# EasyEDA schematic Project-12 11.json

## Sheets
1 Sheet_1: TITLE: Sheet_1; REV: 1.0; Date: 2024-11-12; Sheet: 1/1; Company: Your Company
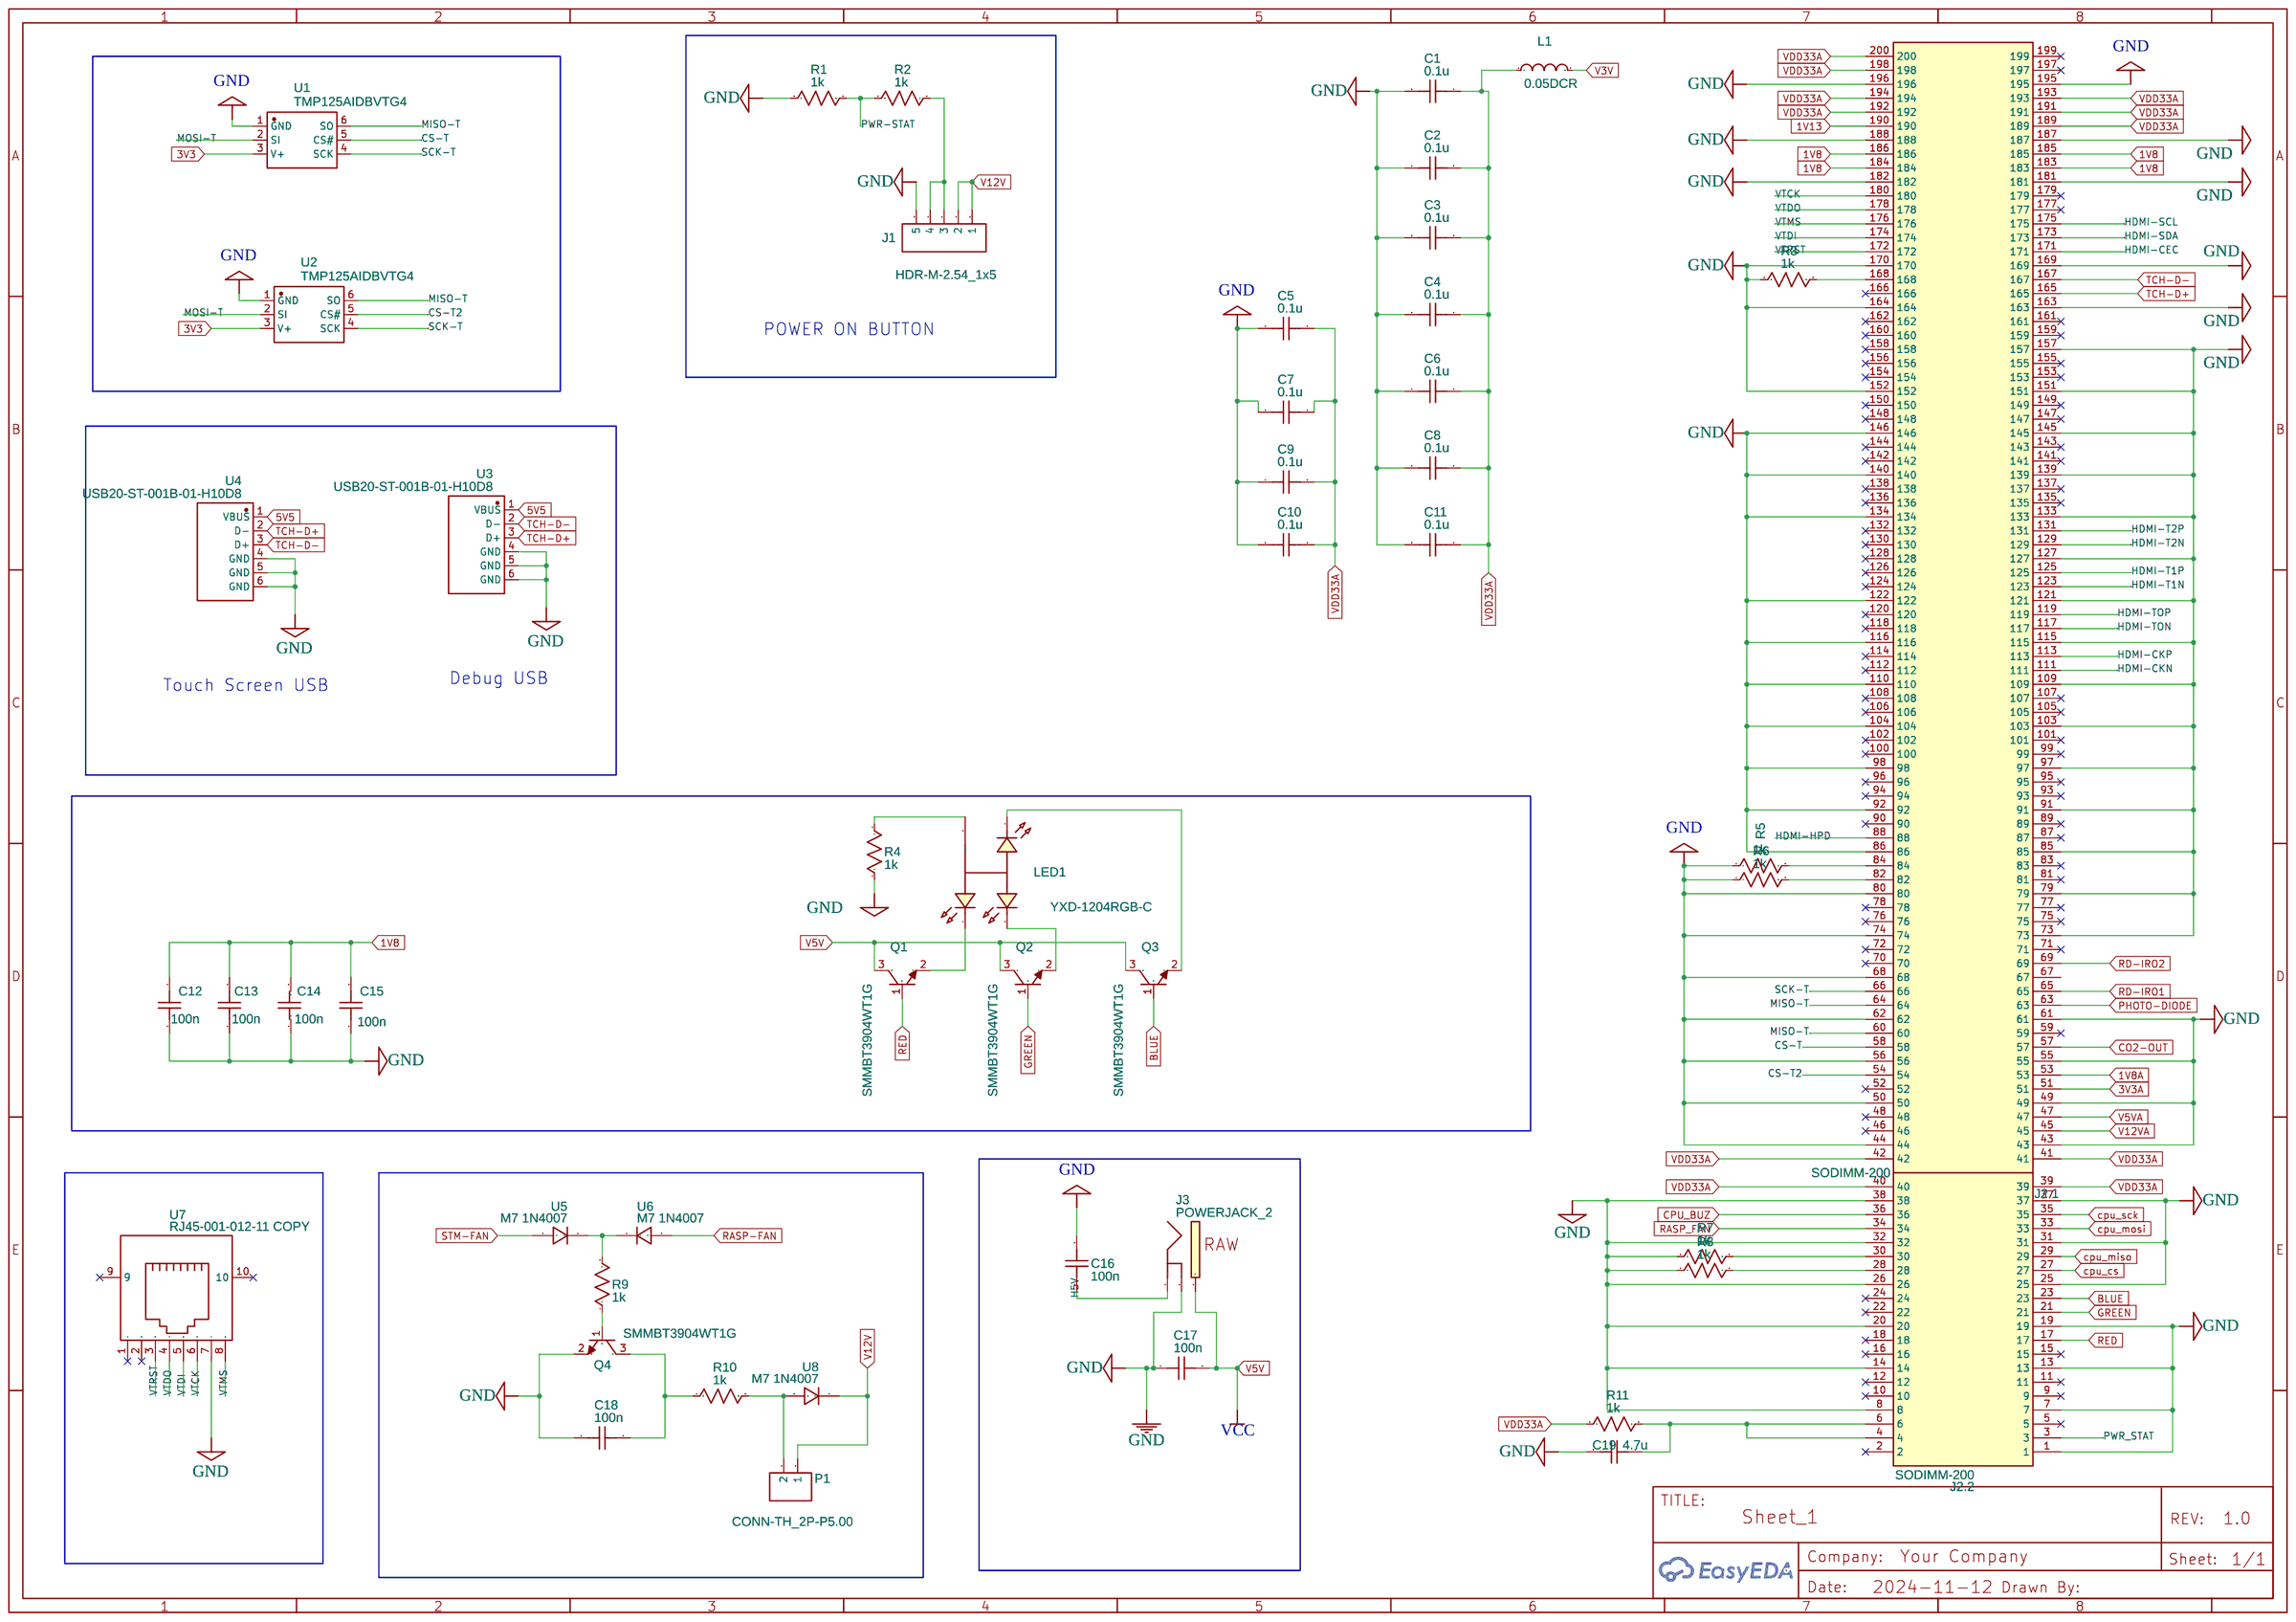
[diagram p0: Sheet_1]
2 Sheet_2: TITLE: Sheet_2
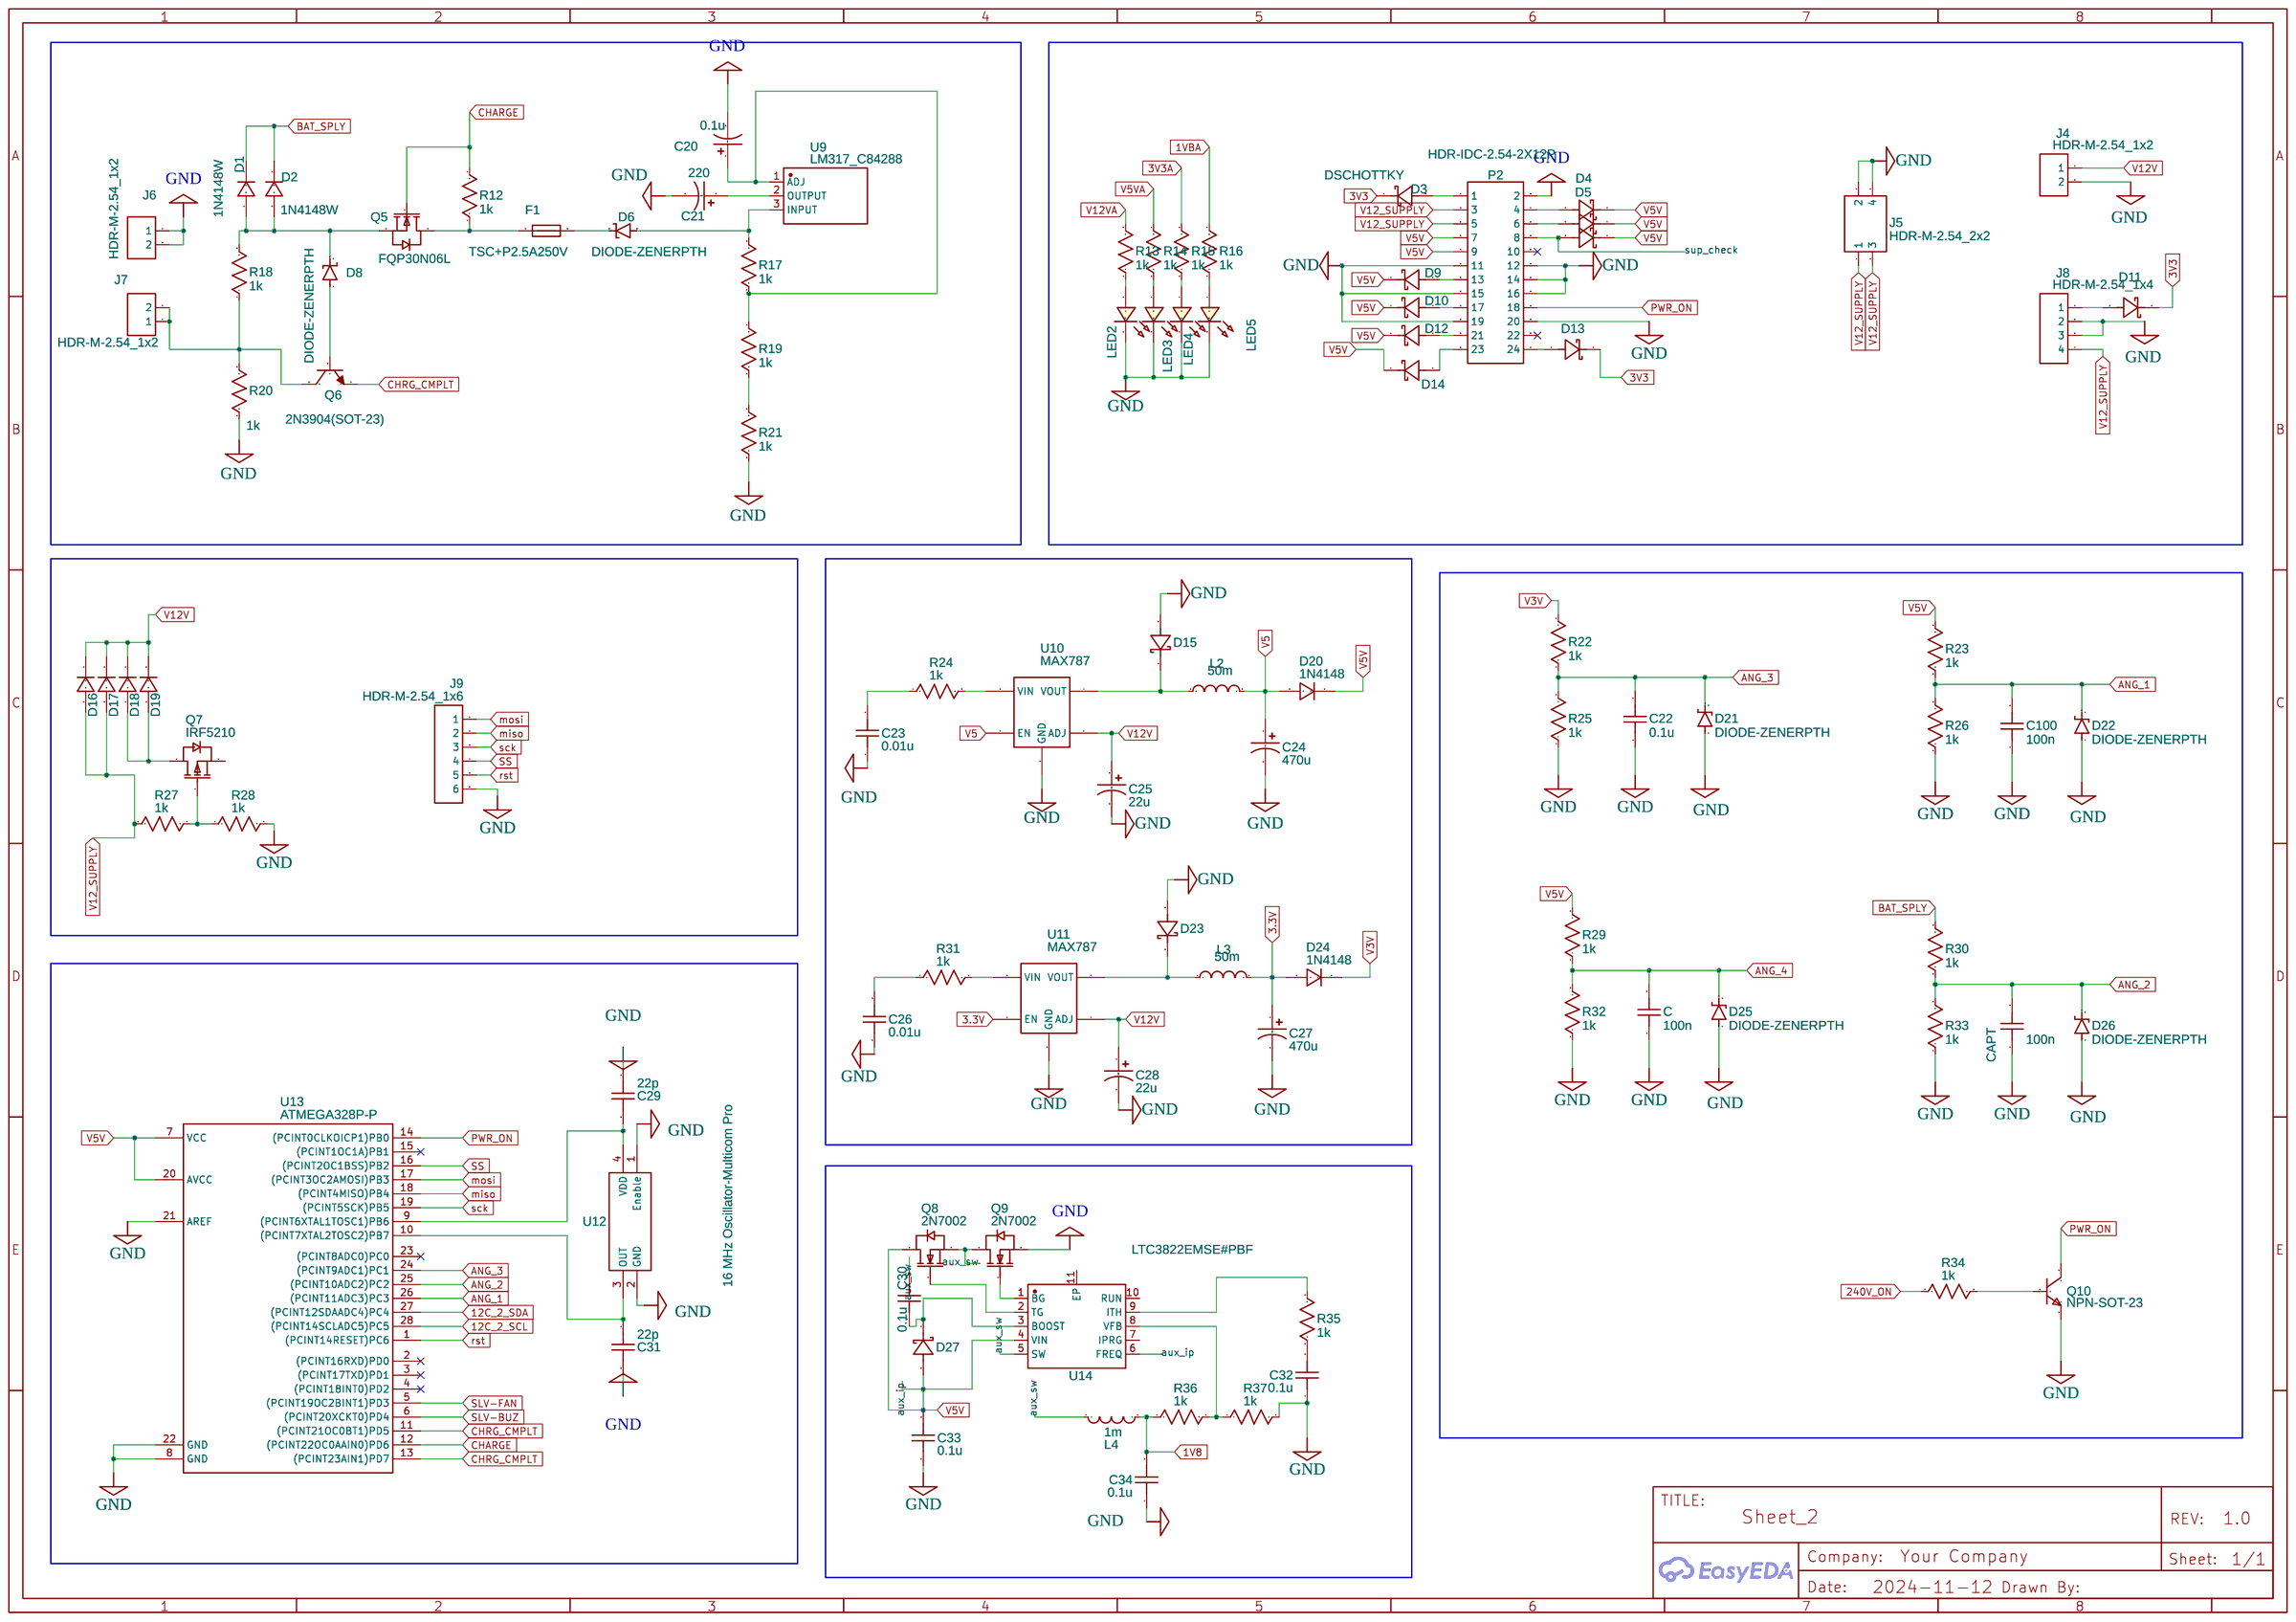
[diagram p1: Sheet_2]
3 Sheet_3: TITLE: Sheet_3
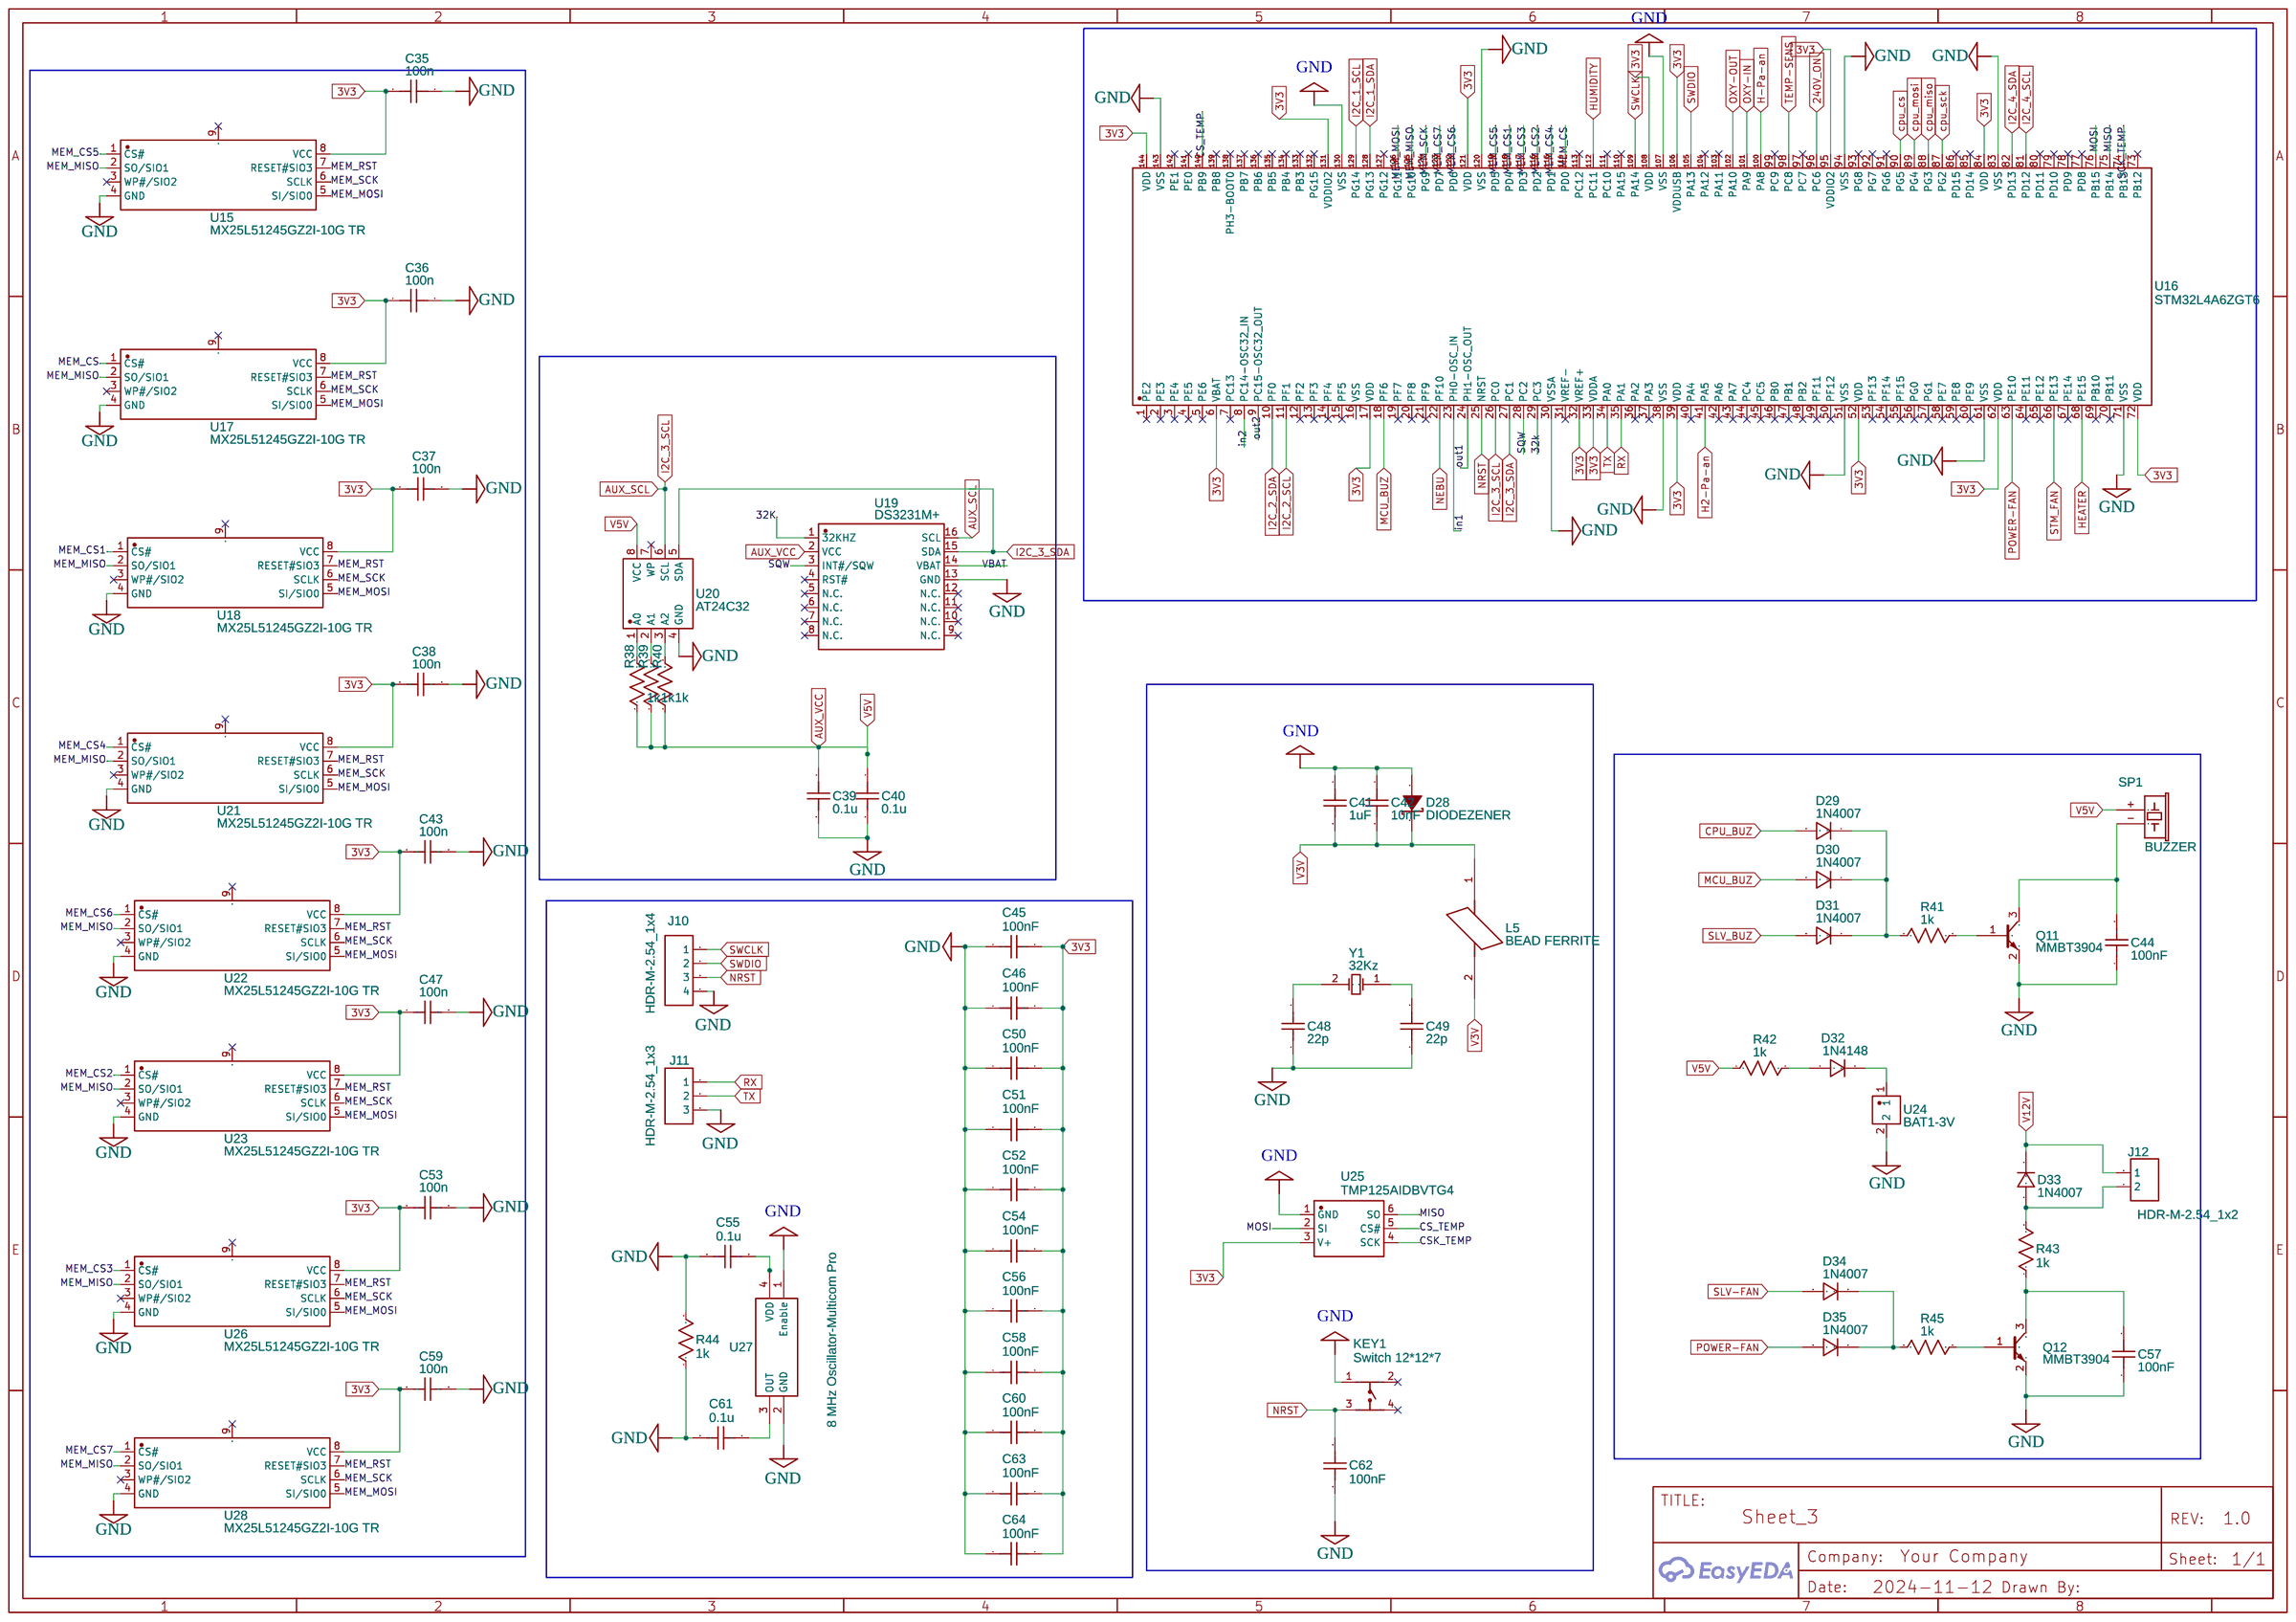
[diagram p2: Sheet_3]
4 Sheet_4: TITLE: Sheet_4
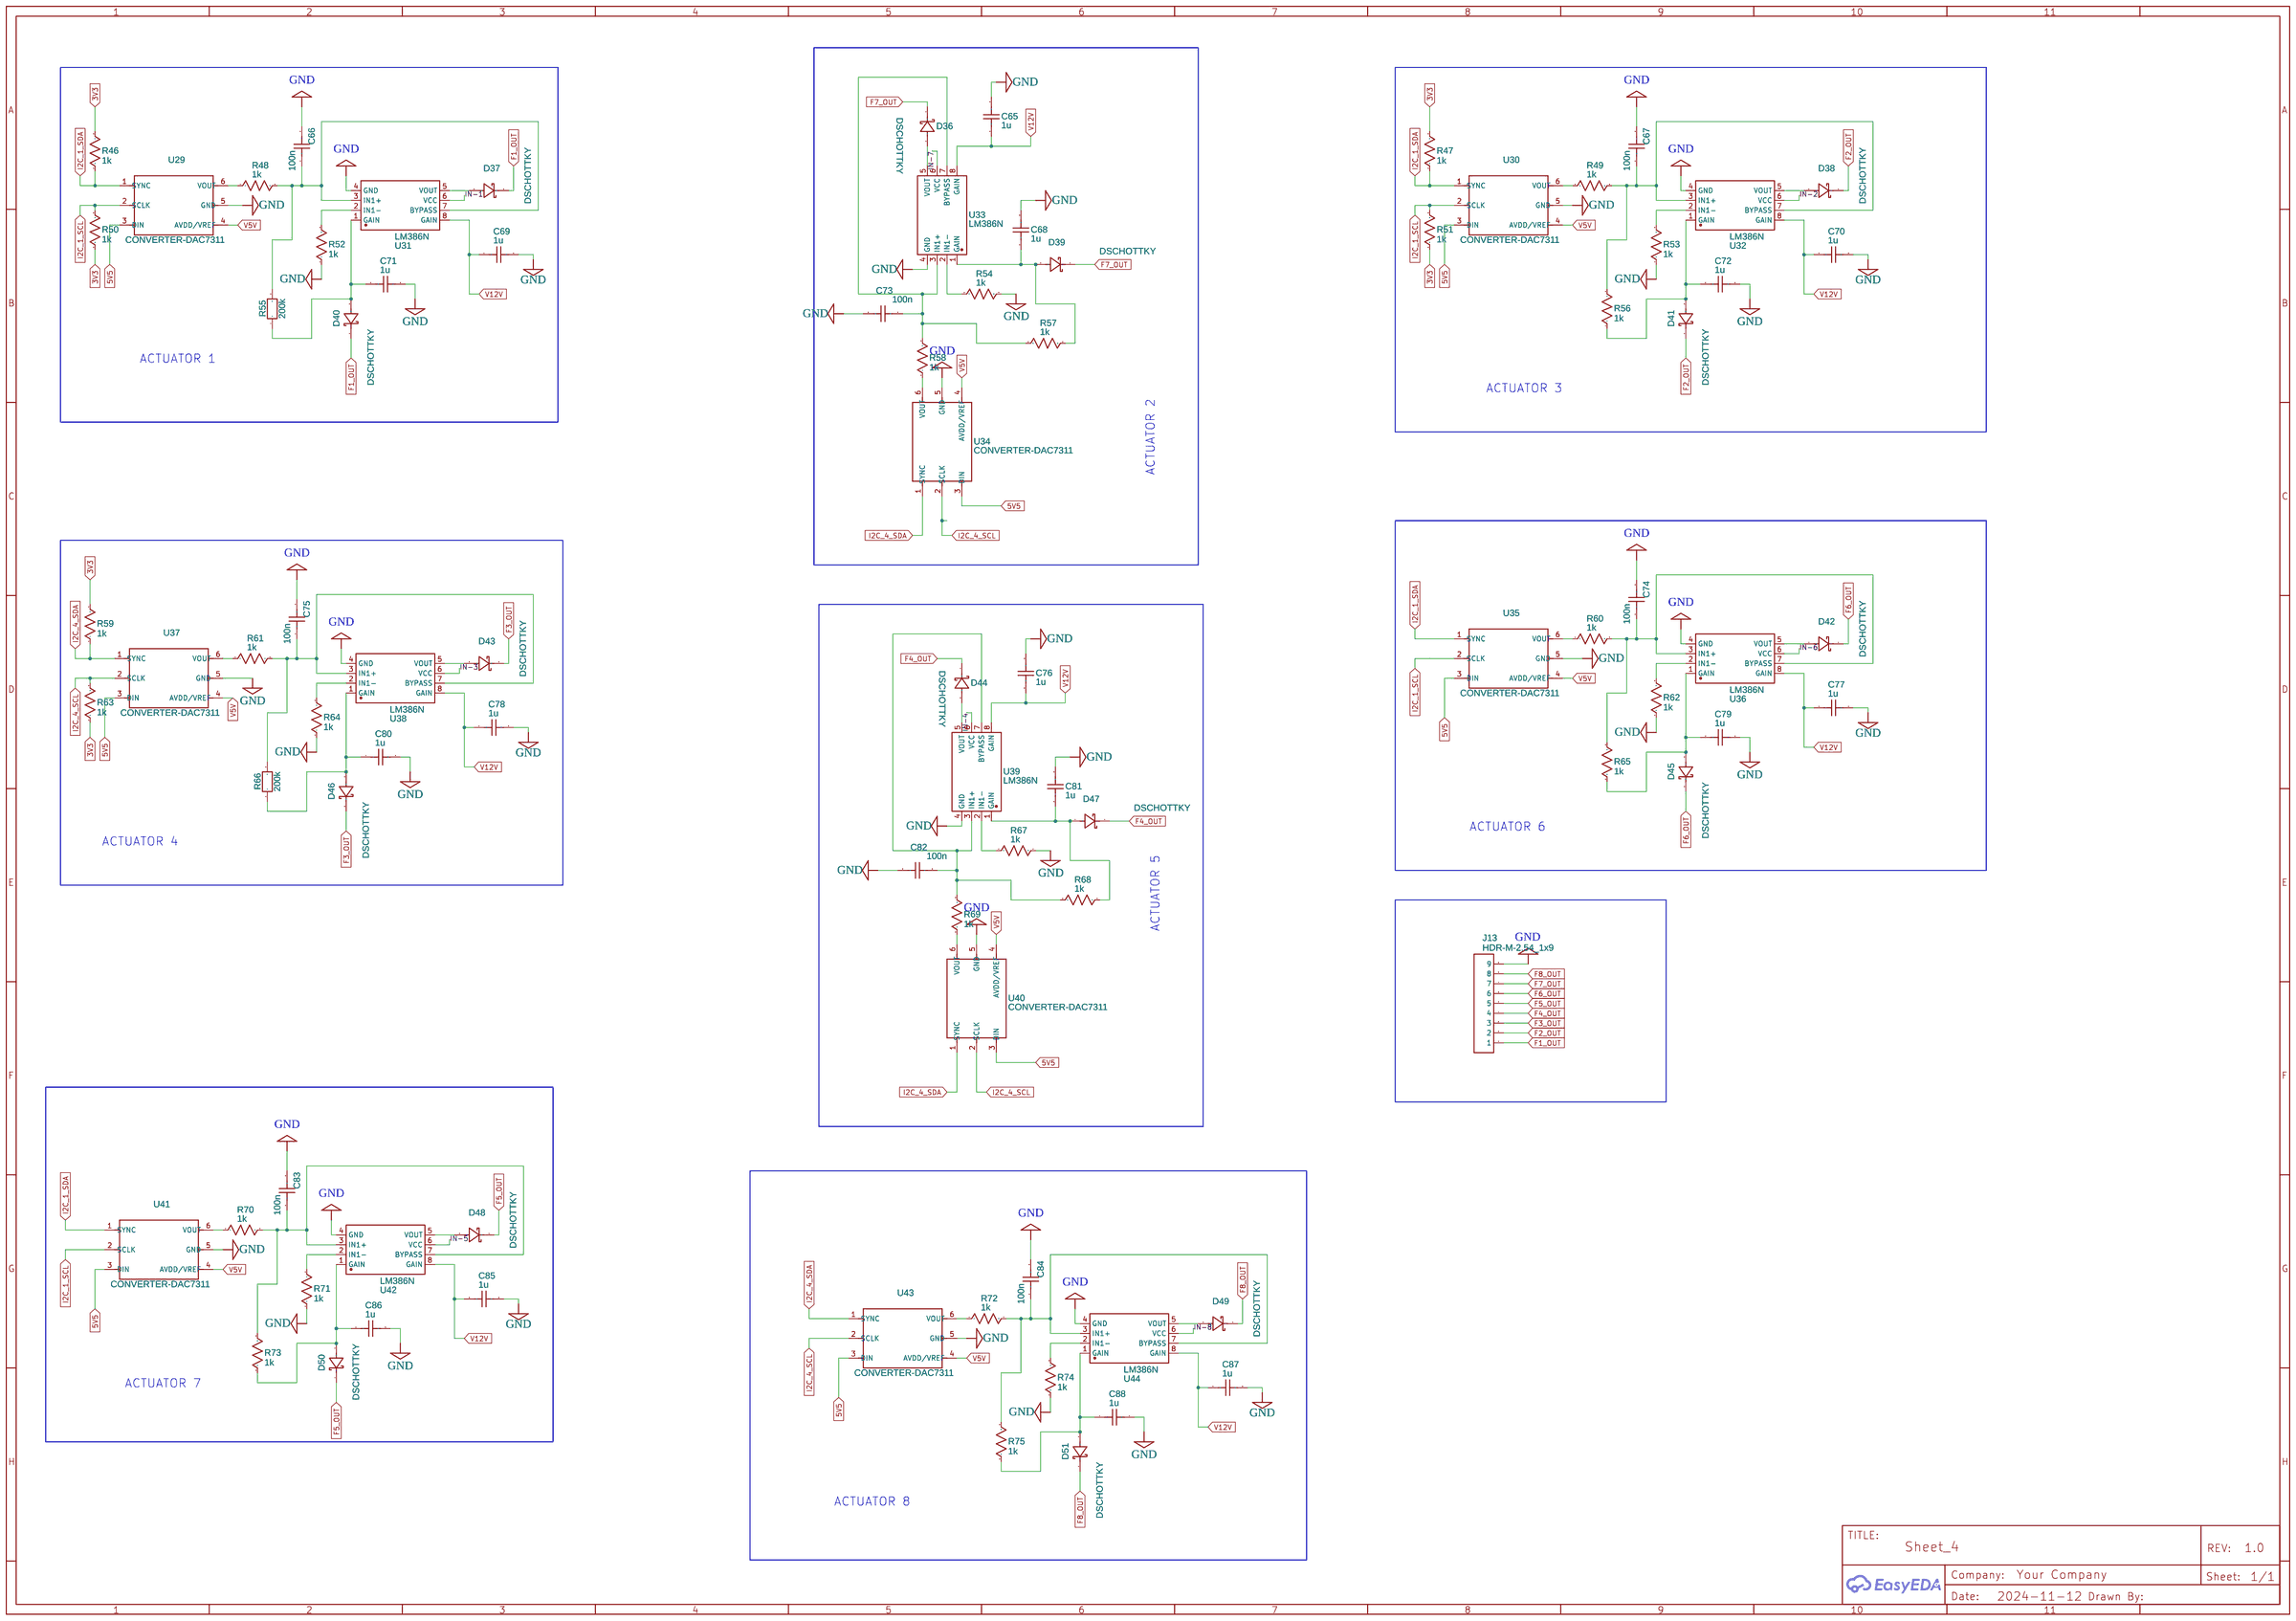
[diagram p3: Sheet_4]
5 Sheet_5: TITLE: Sheet_5
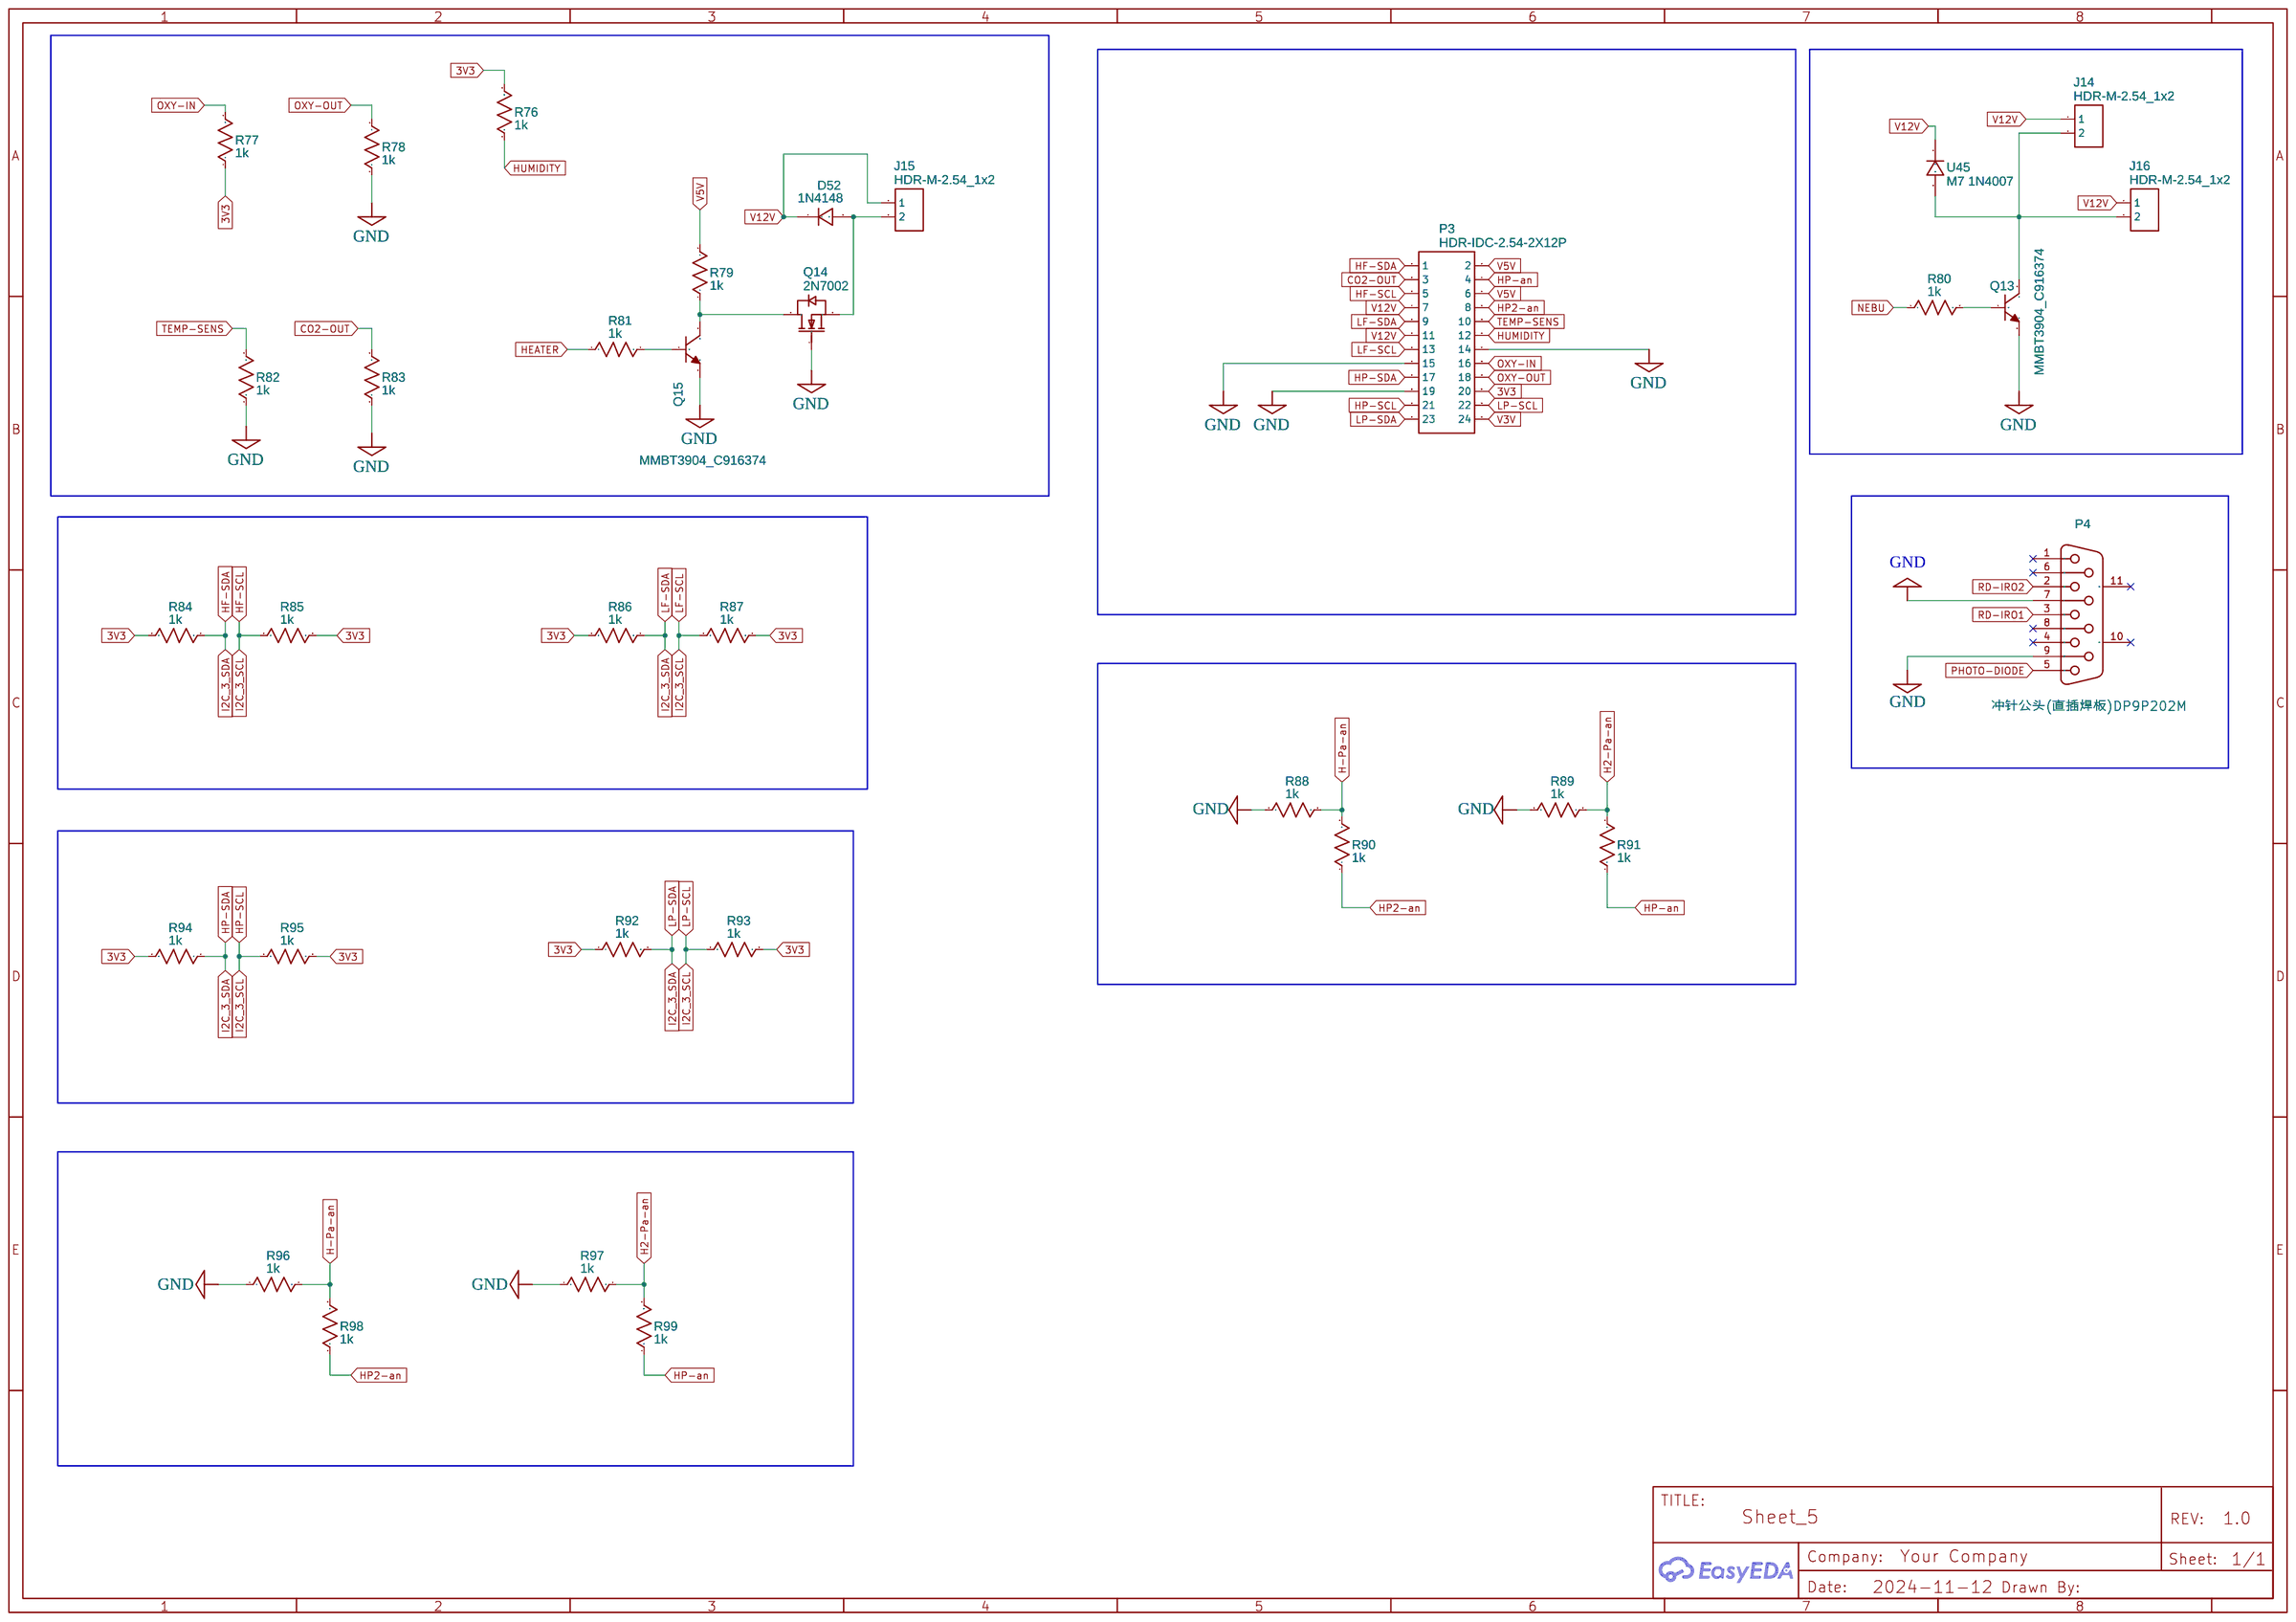
[diagram p4: Sheet_5]

## Parts
sheet Sheet_1
C1  0.1u  [C0603]
C2  0.1u  [C0603]
C3  0.1u  [C0603]
C4  0.1u  [C0603]
C5  0.1u  [C0603]
C6  0.1u  [C0603]
C7  0.1u  [C0603]
C8  0.1u  [C0603]
C9  0.1u  [C0603]
C10  0.1u  [C0603]
C11  0.1u  [C0603]
C12  100n  [C0201]
C13  100n  [C0201]
C14  100n  [C0201]
C15  100n  [C0201]
C16  100n  [C0201]
C17  100n  [C0201]
C18  100n  [C0201]
C19  4.7u  [C0201]
J1  HDR-M-2.54_1x5  [HDR-M-2.54_1X5]
J2  SODIMM-200  [CONN-SMD_200P-P0.60_DDR2-SODIMM-200P]  (sections 1,2)
J3  POWERJACK_2  [POWER_JACK_BO]
L1  0.05DCR  [L0603]
LED1  YXD-1204RGB-C  [LED-SMD_YXD-1204RGB-C]
P1  CONN-TH_2P-P5.00  [CONN-TH_2P-P5.00]
Q1  SMMBT3904WT1G  [SOT-323-3_L2.0-W1.3-P1.30-LS2.1-BR]
Q2  SMMBT3904WT1G  [SOT-323-3_L2.0-W1.3-P1.30-LS2.1-BR]
Q3  SMMBT3904WT1G  [SOT-323-3_L2.0-W1.3-P1.30-LS2.1-BR]
Q4  SMMBT3904WT1G  [SOT-323-3_L2.0-W1.3-P1.30-LS2.1-BR]
R1  1k  [R0603]
R2  1k  [R0603]
R3  1k  [R0603]
R4  1k  [R0603]
R5  1k  [R0603]
R6  1k  [R0603]
R7  1k  [R0603]
R8  1k  [R0603]
R9  1k  [R0603]
R10  1k  [R0603]
R11  1k  [R0603]
U1  TMP125AIDBVTG4  [SOT-23-6_L2.9-W1.6-P0.95-LS2.8-BR]
U2  TMP125AIDBVTG4  [SOT-23-6_L2.9-W1.6-P0.95-LS2.8-BR]
U3  USB20-ST-001B-01-H10D8  [USB-B-TH_USB-B10-BRW]
U4  USB20-ST-001B-01-H10D8  [USB-B-TH_USB-B10-BRW]
U5  M7 1N4007  [SMA_L4.4-W2.8-LS5.4-RD]
U6  M7 1N4007  [SMA_L4.4-W2.8-LS5.4-RD]
U7  RJ45-001-012-11 COPY  [RJ45-TH_RJ45-001-012-11]
U8  M7 1N4007  [SMA_L4.4-W2.8-LS5.4-RD]
sheet Sheet_2
C  100n  [C0201]
C20  0.1u  [CASE-A_3216]
C21  220  [CASE-A_3216]
C22  0.1u  [C0201]
C23  0.01u  [C0201]
C24  470u  [CASE-A_3216]
C25  22u  [CASE-A_3216]
C26  0.01u  [C0201]
C27  470u  [CASE-A_3216]
C28  22u  [CASE-A_3216]
C29  22p  [C0201]
C30  0.1u  [C0201]
C31  22p  [C0201]
C32  0.1u  [C0201]
C33  0.1u  [C0201]
C34  0.1u  [C0201]
C100  100n  [C0201]
CAPT  100n  [C0201]
D1  1N4148W  [SOD-123FL_L2.6-W1.6-LS3.4-RD]
D2  1N4148W  [SOD-123FL_L2.6-W1.6-LS3.4-RD]
D3  DSCHOTTKY  [D-FLAT_L4.3-W2.6-LS5.3-RD]
D4  DSCHOTTKY  [D-FLAT_L4.3-W2.6-LS5.3-RD]
D5  DSCHOTTKY  [D-FLAT_L4.3-W2.6-LS5.3-RD]
D6  DIODE-ZENERPTH  [DIODE-ZENER]
D7  DSCHOTTKY  [D-FLAT_L4.3-W2.6-LS5.3-RD]
D8  DIODE-ZENERPTH  [DIODE-ZENER]
D9  DSCHOTTKY  [D-FLAT_L4.3-W2.6-LS5.3-RD]
D10  DSCHOTTKY  [D-FLAT_L4.3-W2.6-LS5.3-RD]
D11  DSCHOTTKY  [D-FLAT_L4.3-W2.6-LS5.3-RD]
D12  DSCHOTTKY  [D-FLAT_L4.3-W2.6-LS5.3-RD]
D13  DSCHOTTKY  [D-FLAT_L4.3-W2.6-LS5.3-RD]
D14  DSCHOTTKY  [D-FLAT_L4.3-W2.6-LS5.3-RD]
D15  DSCHOTTKY  [D-FLAT_L4.3-W2.6-LS5.3-RD]
D16  1N4148W  [SOD-123FL_L2.6-W1.6-LS3.4-RD]
D17  1N4148W  [SOD-123FL_L2.6-W1.6-LS3.4-RD]
D18  1N4148W  [SOD-123FL_L2.6-W1.6-LS3.4-RD]
D19  1N4148W  [SOD-123FL_L2.6-W1.6-LS3.4-RD]
D20  1N4148  [DO-35_BD2.0-L4.2-P8.20-D0.5-RD]
D21  DIODE-ZENERPTH  [DIODE-ZENER]
D22  DIODE-ZENERPTH  [DIODE-ZENER]
D23  DSCHOTTKY  [D-FLAT_L4.3-W2.6-LS5.3-RD]
D24  1N4148  [DO-35_BD2.0-L4.2-P8.20-D0.5-RD]
D25  DIODE-ZENERPTH  [DIODE-ZENER]
D26  DIODE-ZENERPTH  [DIODE-ZENER]
D27  DSCHOTTKY  [D-FLAT_L4.3-W2.6-LS5.3-RD]
F1  TSC+P2.5A250V  [FUSE-TH_BD5.6-L21.0-P25.00-D0.7]
J4  HDR-M-2.54_1x2  [HDR-M-2.54_1X2]
J5  HDR-M-2.54_2x2  [HDR-M-2.54_2X2]
J6  HDR-M-2.54_1x2  [HDR-M-2.54_1X2]
J7  HDR-M-2.54_1x2  [HDR-M-2.54_1X2]
J8  HDR-M-2.54_1x4  [HDR-M-2.54_1X4]
J9  HDR-M-2.54_1x6  [HDR-M-2.54_1X6]
L2  50m  [L0603]
L3  50m  [L0603]
L4  1m  [L0603]
LED2  LED-0603_R  [LED0603_RED]
LED3  LED-0603_R  [LED0603_RED]
LED4  LED-0603_R  [LED0603_RED]
LED5  LED-0603_R  [LED0603_RED]
P2  HDR-IDC-2.54-2X12P  [IDC-TH_24P-P2.54-V-R2-C12-S2.54]
Q5  FQP30N06L  [TO-220AB-3_L10.3-W5.0-P2.54-L]
Q6  2N3904(SOT-23)  [SOT-23-3_L2.9-W1.3-P1.90-LS2.4-TR]
Q7  IRF5210  [TO-263-2_L10.0-W9.1-P5.08-LS15.2-BR]
Q8  2N7002  [SOT-23_L2.9-W1.3-P0.95-LS2.4-BR]
Q9  2N7002  [SOT-23_L2.9-W1.3-P0.95-LS2.4-BR]
Q10  NPN-SOT-23  [SOT-23-3_L2.9-W1.3-P0.95-LS2.4-BR]
R12  1k  [R0603]
R13  1k  [R0603]
R14  1k  [R0603]
R15  1k  [R0603]
R16  1k  [R0603]
R17  1k  [R0603]
R18  1k  [R0603]
R19  1k  [R0603]
R20  1k  [R0603]
R21  1k  [R0603]
R22  1k  [R0603]
R23  1k  [R0603]
R24  1k  [R0603]
R25  1k  [R0603]
R26  1k  [R0603]
R27  1k  [R0603]
R28  1k  [R0603]
R29  1k  [R0603]
R30  1k  [R0603]
R31  1k  [R0603]
R32  1k  [R0603]
R33  1k  [R0603]
R34  1k  [R0603]
R35  1k  [R0603]
R36  1k  [R0603]
R37  1k  [R0603]
U9  LM317_C84288  [TO-263-2_L10.1-W9.1-P5.08-LS15.2-TL]
U10  MAX787  [MAX787-SOT]
U11  MAX787  [MAX787-SOT]
U12  16 MHz Oscillator-Multicom Pro  [MCSJK-3N-12.00-3.3-25-C]
U13  ATMEGA328P-P  [ATMEGA328P-PU]
U14  LTC3822EMSE#PBF  [MSOP-10_L3.0-W3.0-P0.50-LS4.9-BL-EP]
sheet Sheet_3
C35  100n  [C0201]
C36  100n  [C0201]
C37  100n  [C0201]
C38  100n  [C0201]
C39  0.1u  [C0201]
C40  0.1u  [C0201]
C41  1uF  [C0201]
C42  10nF  [C0201]
C43  100n  [C0201]
C44  100nF  [C0201]
C45  100nF  [C0201]
C46  100nF  [C0201]
C47  100n  [C0201]
C48  22p  [C0201]
C49  22p  [C0201]
C50  100nF  [C0201]
C51  100nF  [C0201]
C52  100nF  [C0201]
C53  100n  [C0201]
C54  100nF  [C0201]
C55  0.1u  [C0201]
C56  100nF  [C0201]
C57  100nF  [C0201]
C58  100nF  [C0201]
C59  100n  [C0201]
C60  100nF  [C0201]
C61  0.1u  [C0201]
C62  100nF  [C0201]
C63  100nF  [C0201]
C64  100nF  [C0201]
D28  DIODEZENER  [SOD-523_L1.2-W0.8-LS1.6-RD]
D29  1N4007  [DO-41_BD2.4-L4.7-P8.70-D0.9-RD]
D30  1N4007  [DO-41_BD2.4-L4.7-P8.70-D0.9-RD]
D31  1N4007  [DO-41_BD2.4-L4.7-P8.70-D0.9-RD]
D32  1N4148  [DO-35_BD2.0-L4.2-P8.20-D0.5-RD]
D33  1N4007  [DO-41_BD2.4-L4.7-P8.70-D0.9-RD]
D34  1N4007  [DO-41_BD2.4-L4.7-P8.70-D0.9-RD]
D35  1N4007  [DO-41_BD2.4-L4.7-P8.70-D0.9-RD]
J10  HDR-M-2.54_1x4  [HDR-M-2.54_1X4]
J11  HDR-M-2.54_1x3  [HDR-M-2.54_1X3]
J12  HDR-M-2.54_1x2  [HDR-M-2.54_1X2]
KEY1  Switch 12*12*7  [KEY-TH_4P-L12.0-W12.0-P5.00-LS12.5]
L5  BEAD FERRITE  [BEAD FERRITE]
Q11  MMBT3904  [SOT-23]
Q12  MMBT3904  [SOT-23]
R38  1k  [R0603]
R39  1k  [R0603]
R40  1k  [R0603]
R41  1k  [R0603]
R42  1k  [R0603]
R43  1k  [R0603]
R44  1k  [R0603]
R45  1k  [R0603]
SP1  BUZZER  [BUZZER-12MM-KIT]
U15  MX25L51245GZ2I-10G TR  [WSON-8_L8.0-W6.0-P1.27-TL-EP]
U16  STM32L4A6ZGT6  [LQFP-144_L20.0-W20.0-P0.50-LS22.0-BL]
U17  MX25L51245GZ2I-10G TR  [WSON-8_L8.0-W6.0-P1.27-TL-EP]
U18  MX25L51245GZ2I-10G TR  [WSON-8_L8.0-W6.0-P1.27-TL-EP]
U19  DS3231M+  [SOIC-16_L10.3-W7.5-P1.27-LS10.3-BL]
U20  AT24C32  [SO-8_L4.9-W3.9-P1.27-LS6.0-TL]
U21  MX25L51245GZ2I-10G TR  [WSON-8_L8.0-W6.0-P1.27-TL-EP]
U22  MX25L51245GZ2I-10G TR  [WSON-8_L8.0-W6.0-P1.27-TL-EP]
U23  MX25L51245GZ2I-10G TR  [WSON-8_L8.0-W6.0-P1.27-TL-EP]
U24  BAT1-3V  [BAT-SMD_BAT1-3V]
U25  TMP125AIDBVTG4  [SOT-23-6_L2.9-W1.6-P0.95-LS2.8-BR]
U26  MX25L51245GZ2I-10G TR  [WSON-8_L8.0-W6.0-P1.27-TL-EP]
U27  8 MHz Oscillator-Multicom Pro  [MCSJK-3N-12.00-3.3-25-C]
U28  MX25L51245GZ2I-10G TR  [WSON-8_L8.0-W6.0-P1.27-TL-EP]
Y1  32Kz  [XTAL_US]
sheet Sheet_4
C65  1u  [C0201]
C66  100n  [C0201]
C67  100n  [C0201]
C68  1u  [C0201]
C69  1u  [C0201]
C70  1u  [C0201]
C71  1u  [C0201]
C72  1u  [C0201]
C73  100n  [C0201]
C74  100n  [C0201]
C75  100n  [C0201]
C76  1u  [C0201]
C77  1u  [C0201]
C78  1u  [C0201]
C79  1u  [C0201]
C80  1u  [C0201]
C81  1u  [C0201]
C82  100n  [C0201]
C83  100n  [C0201]
C84  100n  [C0201]
C85  1u  [C0201]
C86  1u  [C0201]
C87  1u  [C0201]
C88  1u  [C0201]
D36  DSCHOTTKY  [D-FLAT_L4.3-W2.6-LS5.3-RD]
D37  DSCHOTTKY  [D-FLAT_L4.3-W2.6-LS5.3-RD]
D38  DSCHOTTKY  [D-FLAT_L4.3-W2.6-LS5.3-RD]
D39  DSCHOTTKY  [D-FLAT_L4.3-W2.6-LS5.3-RD]
D40  DSCHOTTKY  [D-FLAT_L4.3-W2.6-LS5.3-RD]
D41  DSCHOTTKY  [D-FLAT_L4.3-W2.6-LS5.3-RD]
D42  DSCHOTTKY  [D-FLAT_L4.3-W2.6-LS5.3-RD]
D43  DSCHOTTKY  [D-FLAT_L4.3-W2.6-LS5.3-RD]
D44  DSCHOTTKY  [D-FLAT_L4.3-W2.6-LS5.3-RD]
D45  DSCHOTTKY  [D-FLAT_L4.3-W2.6-LS5.3-RD]
D46  DSCHOTTKY  [D-FLAT_L4.3-W2.6-LS5.3-RD]
D47  DSCHOTTKY  [D-FLAT_L4.3-W2.6-LS5.3-RD]
D48  DSCHOTTKY  [D-FLAT_L4.3-W2.6-LS5.3-RD]
D49  DSCHOTTKY  [D-FLAT_L4.3-W2.6-LS5.3-RD]
D50  DSCHOTTKY  [D-FLAT_L4.3-W2.6-LS5.3-RD]
D51  DSCHOTTKY  [D-FLAT_L4.3-W2.6-LS5.3-RD]
J13  HDR-M-2.54_1x9  [HDR-M-2.54_1X9]
R46  1k  [R0603]
R47  1k  [R0603]
R48  1k  [R0603]
R49  1k  [R0603]
R50  1k  [R0603]
R51  1k  [R0603]
R52  1k  [R0603]
R53  1k  [R0603]
R54  1k  [R0603]
R55  200k  [R_AXIAL-0.4]
R56  1k  [R0603]
R57  1k  [R0603]
R58  1k  [R0603]
R59  1k  [R0603]
R60  1k  [R0603]
R61  1k  [R0603]
R62  1k  [R0603]
R63  1k  [R0603]
R64  1k  [R0603]
R65  1k  [R0603]
R66  200k  [R_AXIAL-0.4]
R67  1k  [R0603]
R68  1k  [R0603]
R69  1k  [R0603]
R70  1k  [R0603]
R71  1k  [R0603]
R72  1k  [R0603]
R73  1k  [R0603]
R74  1k  [R0603]
R75  1k  [R0603]
U29  CONVERTER-DAC7311  [SC-70-6]
U30  CONVERTER-DAC7311  [SC-70-6]
U31  LM386N  [DIP-8_L9.7-W6.4-P2.54-LS7.6-BL]
U32  LM386N  [DIP-8_L9.7-W6.4-P2.54-LS7.6-BL]
U33  LM386N  [DIP-8_L9.7-W6.4-P2.54-LS7.6-BL]
U34  CONVERTER-DAC7311  [SC-70-6]
U35  CONVERTER-DAC7311  [SC-70-6]
U36  LM386N  [DIP-8_L9.7-W6.4-P2.54-LS7.6-BL]
U37  CONVERTER-DAC7311  [SC-70-6]
U38  LM386N  [DIP-8_L9.7-W6.4-P2.54-LS7.6-BL]
U39  LM386N  [DIP-8_L9.7-W6.4-P2.54-LS7.6-BL]
U40  CONVERTER-DAC7311  [SC-70-6]
U41  CONVERTER-DAC7311  [SC-70-6]
U42  LM386N  [DIP-8_L9.7-W6.4-P2.54-LS7.6-BL]
U43  CONVERTER-DAC7311  [SC-70-6]
U44  LM386N  [DIP-8_L9.7-W6.4-P2.54-LS7.6-BL]
sheet Sheet_5
D52  1N4148  [DO-35_BD2.0-L4.2-P8.20-D0.5-RD]
J14  HDR-M-2.54_1x2  [HDR-M-2.54_1X2]
J15  HDR-M-2.54_1x2  [HDR-M-2.54_1X2]
J16  HDR-M-2.54_1x2  [HDR-M-2.54_1X2]
P3  HDR-IDC-2.54-2X12P  [IDC-TH_24P-P2.54-V-R2-C12-S2.54]
P4  冲针公头(直插焊板)DP9P202M  [DB9-TH_DB9SS]
Q13  MMBT3904_C916374  [SOT-23-3_L2.9-W1.3-P1.90-LS2.4-BR]
Q14  2N7002  [SOT-23_L2.9-W1.3-P0.95-LS2.4-BR]
Q15  MMBT3904_C916374  [SOT-23-3_L2.9-W1.3-P1.90-LS2.4-BR]
R76  1k  [R0603]
R77  1k  [R0603]
R78  1k  [R0603]
R79  1k  [R0603]
R80  1k  [R0603]
R81  1k  [R0603]
R82  1k  [R0603]
R83  1k  [R0603]
R84  1k  [R0603]
R85  1k  [R0603]
R86  1k  [R0603]
R87  1k  [R0603]
R88  1k  [R0603]
R89  1k  [R0603]
R90  1k  [R0603]
R91  1k  [R0603]
R92  1k  [R0603]
R93  1k  [R0603]
R94  1k  [R0603]
R95  1k  [R0603]
R96  1k  [R0603]
R97  1k  [R0603]
R98  1k  [R0603]
R99  1k  [R0603]
U45  M7 1N4007  [SMA_L4.4-W2.8-LS5.4-RD]

## Library data of the parts
C1-C11 = C_0603_US: Contributor: LCEDA_Lib
C C12-C19 C22 C23 C26 C29-C88 C100 CAPT = C_0201_US: Contributor: LCEDA_Lib
J1 = HDR-M-2.54_1x5: Supplier Part: C358687; Supplier: LCSC; Contributor: LCEDA_Lib
J2 = SODIMM-200: Contributor: Fly_0ut; subpart_no: 1
J3 = POWERJACK_2: Contributor: AntonX; sourceId: LJ0UcuM4m
L1-L4 = L0603_US: Contributor: LCEDA_Lib
LED1 = YXD-1204RGB-C: Contributor: LCSC; Supplier: LCSC; Supplier Part: C9900001072; Manufacturer: null; JLCPCB Part Class: Extended Part
P1 = CONN-TH_2P-P5.00: Supplier: LCSC; Contributor: LCEDA_Lib
Q1-Q4 = SMMBT3904WT1G: Contributor: LCSC; Supplier: LCSC; Supplier Part: C232649; Manufacturer: onsemi(安森美); JLCPCB Part Class: Extended Part
R1-R54 R56-R65 R67-R99 = R_0603_US: Contributor: LCEDA_Lib
U1 U2 U25 = TMP125AIDBVTG4: Supplier: LCSC; Supplier Part: C7362888; Manufacturer: TI(德州仪器); Contributor: lcsc; JLCPCB Part Class: Extended Part
U3 U4 = USB20-ST-001B-01-H10D8: Contributor: lcsc; Supplier: LCSC; Supplier Part: C9900013838; Manufacturer: null; JLCPCB Part Class: Extended Part
U5 U6 U8 U45 = M7 1N4007: Contributor: lcsc; Supplier: LCSC; Supplier Part: C5337558; Manufacturer: JUXING(钜兴); JLCPCB Part Class: Extended Part
U7 = RJ45-001-012-11 COPY: Supplier: LCSC; Supplier Part: C7421392; Manufacturer: XUNPU(讯普); Manufacturer Part: RJ45-001-012-11; JLCPCB Part Class: Extended Part; Contributor: lcsc
C20 C21 C24 C25 C27 C28 = C_Tan_SMD_A_US: Contributor: LCEDA_Lib
D1 D2 D16-D19 = 1N4148W: Supplier: LCSC; Manufacturer: Tak Cheong; Contributor: LCEDA_Lib; Supplier Part: C129216
D3-D5 D7 D9-D15 D23 D27 D36-D51 = DSCHOTTKY: Contributor: LCSC; Supplier: LCSC; Supplier Part: C9900012836; Manufacturer: null; Manufacturer Part: DSchottky; JLCPCB Part Class: Extended Part
D6 D8 D21 D22 D25 D26 = DIODE-ZENERPTH: Contributor: SebSebSeb
D20 D24 D32 D52 = 1N4148: Supplier: LCSC; Supplier Part: C13769; Manufacturer: STMicroelectronics; Contributor: LCSC
F1 = TSC+P2.5A250V: Contributor: LCSC; Supplier: LCSC; Supplier Part: C354924; Manufacturer: WALTER(华德); Manufacturer Part: TSC+PT2.5AH250V; JLCPCB Part Class: Extended Part
J4 J6 J7 J12 J14-J16 = HDR-M-2.54_1x2: Supplier Part: C124375; Supplier: LCSC; Contributor: LCEDA_Lib
J5 = HDR-M-2.54_2x2: Supplier Part: C66690; Supplier: LCSC; Contributor: LCEDA_Lib
J8 J10 = HDR-M-2.54_1x4: Supplier Part: C124378; Supplier: LCSC; Contributor: LCEDA_Lib
J9 = HDR-M-2.54_1x6: Supplier Part: C190819; Supplier: LCSC; Contributor: LCEDA_Lib
LED2-LED5 = LED-0603_R: Manufacturer: EVERLIGHT(台湾亿光); Manufacturer Part: 19-217/R6C-AL1M2VY/3T; Supplier Part: C72044; Supplier: LCSC; Contributor: LCEDA_01
P2 P3 = HDR-IDC-2.54-2X12P: Supplier: LCSC; Manufacturer: BOOMELE; Manufacturer Part: IDC Box 2X12 2.54MM; image: //image.lceda.cn/szlcsc/C9137.jpg; Supplier Part: C9137
Q5 = FQP30N06L: Contributor: LCSC; Supplier: LCSC; Supplier Part: C878826; Manufacturer: VBsemi(微碧半导体); Manufacturer Part: FQP30N06L-VB; JLCPCB Part Class: Extended Part
Q6 = 2N3904(SOT-23): Supplier: LCSC; Manufacturer: KEC; Manufacturer Part: 2n3904S-RTK/PS; Supplier Part: C18536; Paste Type: SOT-23; Contributor: LCEDA_Lib
Q7 = IRF5210: Supplier: LCSC; Manufacturer: IR; Manufacturer Part: IRF5210STRLPBF; image: //image.lceda.cn/szlcsc/C2622.jpg; Supplier Part: C2622; Paste Type: expand; Contributor: LCEDA_Lib
Q8 Q9 Q14 = 2N7002: Supplier: LCSC; Manufacturer: Nexperia; Manufacturer Part: 2N7002,215; image: //image.lceda.cn/szlcsc/C65189.jpg; Supplier Part: C65189; Paste Type: expand; Contributor: LCEDA_Lib
Q10 = NPN-SOT-23: Contributor: LCSC; Supplier: LCSC; Supplier Part: C9900005297; Manufacturer: null; Manufacturer Part: NPN-sot-23
U9 = LM317_C84288: Contributor: LCSC; Supplier: LCSC; Manufacturer: CJ(江苏长电/长晶); Manufacturer Part: LM317; Supplier Part: C84288; JLCPCB Part Class: Extended Part
U10 U11 = MAX787: Contributor: 9sammmmmm
U12 U27 = 12 MHz Oscillator-Multicom Pro: Manufacturer: MULTICOMP PRO; Supplier: Element14; Supplier Part: 2854271; link: https://in.element14.com/multicomp/mcsjk-3n-12-00-3-3-25-c/oscillator-12mhz-3-2mm-x-2-5mm/dp/2854271; Contributor: nikhil.0046
U13 = ATMEGA328P-P: Contributor: KiCad
U14 = LTC3822EMSE#PBF: Contributor: LCSC; Supplier: LCSC; Supplier Part: C686168; Manufacturer: ADI(亚德诺); JLCPCB Part Class: Extended Part
D28 = DIODEZENER3.3V500MWSOD-523: Contributor: lcsc; Supplier: LCSC; Supplier Part: C9900023612; Manufacturer: null; JLCPCB Part Class: Extended Part
D29-D31 D33-D35 = 1N4007: Supplier: LCSC; Manufacturer: SEMTECH; Supplier Part: C106903; Contributor: LCEDA_Lib
J11 = HDR-M-2.54_1x3: Supplier Part: C180248; Supplier: LCSC; Contributor: LCEDA_Lib
KEY1 = Switch 12*12*7: Supplier Part: C14248; Supplier: LCSC; Manufacturer: ReliaPro; JLCPCB Part Class: Extended Part
L5 = BEAD FERRITE: Contributor: NavinL
Q11 Q12 = MMBT3904: Contributor: me2dev
SP1 = BUZZER: Contributor: scorpiontz; Manufacturer Part: CEM-1203; Supplier Part: 490-CEM-1203(42); Supplier: Mouser; Manufacturer: CUI Inc.
U15 U17 U18 U21-U23 U26 U28 = MX25L51245GZ2I-10G TR: Contributor: LCSC; Supplier: LCSC; Supplier Part: C2834727; Manufacturer: MXIC(旺宏电子); JLCPCB Part Class: Extended Part
U16 = STM32L4A6ZGT6: Contributor: LCSC; Supplier: LCSC; Supplier Part: C1337520; Manufacturer: ST(意法半导体); JLCPCB Part Class: Extended Part
U19 = DS3231M+: Contributor: LCSC; Supplier: LCSC; Supplier Part: C1520508; Manufacturer: ADI(亚德诺)/MAXIM(美信); JLCPCB Part Class: Extended Part
U20 = AT24C32: Contributor: LCSC; Supplier: LCSC; Supplier Part: C9900010642; Manufacturer: null; JLCPCB Part Class: Extended Part
U24 = BAT1-3V: Contributor: LCSC; Supplier: LCSC; Supplier Part: C9900005490; Manufacturer: null; JLCPCB Part Class: Extended Part
Y1 = XTAL copy: Crystal Oscillator
J13 = HDR-M-2.54_1x9: Supplier Part: C225484; Supplier: LCSC; Contributor: LCEDA_Lib
R55 R66 = R_AXIAL-0.4_EU: Contributor: LCEDA_Lib
U29 U30 U34 U35 U37 U40 U41 U43 = CONVERTER-DAC7311: GateName_1: G$1; LibraryName: IC-new; Contributor: lucamorandin
U31-U33 U36 U38 U39 U42 U44 = LM386N: Contributor: LCSC; Supplier: LCSC; Supplier Part: C510561; Manufacturer: HTC; JLCPCB Part Class: Extended Part
P4 = 冲针公头(直插焊板)DP9P202M: Contributor: LCSC; Supplier: LCSC; Supplier Part: C9900001561; Manufacturer: null; JLCPCB Part Class: Extended Part
Q13 Q15 = MMBT3904_C916374: Contributor: LCSC; Supplier: LCSC; Supplier Part: C916374; Manufacturer: JSMSEMI(杰盛微); Manufacturer Part: MMBT3904; JLCPCB Part Class: Extended Part

## Nets
1V8: C12.2 C13.2 C14.2 C15.2 C34.2 J2.183 J2.184 J2.185 J2.186 L4.2 R36.1
1V8A: J2.53
1V13: J2.190
1VBA: R16.2
3.3V: C27.1 D24.2 L3.2 U11.2(EN)
3V3: C35.1 C36.1 C37.1 C38.1 C43.1 C45.2 C46.2 C47.1 C50.2 C51.2 C52.2 C53.1 C54.2 C56.2 C58.2 C59.1 C60.2 C63.2 C64.2 D3.1 D11.1 D13.1 P3.20 R46.2 R47.2 R50.1 R51.1 R59.2 R63.1 R76.2 R77.1 R84.1 R85.2 R86.1 R87.2 R92.1 R93.2 R94.1 R95.2 U1.3(V+) U2.3(V+) U15.8(VCC) U16.6(VBAT) U16.17(VDD) U16.32(VREF+) U16.33(VDDA) U16.39(VDD) U16.52(VDD) U16.62(VDD) U16.72(VDD) U16.84(VDD) U16.95(VDDIO2) U16.106(VDDUSB) U16.108(VDD) U16.121(VDD) U16.131(VDDIO2) U16.144(VDD) U17.8(VCC) U18.8(VCC) U21.8(VCC) U22.8(VCC) U23.8(VCC) U25.3(V+) U26.8(VCC) U28.8(VCC)
3V3A: J2.51 R15.2
5V5: U3.1(VBUS) U4.1(VBUS) U29.3(DIN) U30.3(DIN) U34.3(DIN) U35.3(DIN) U37.3(DIN) U40.3(DIN) U41.3(DIN) U43.3(DIN)
240V_ON: R34.1 U16.96(PC6)
GND: C.1 C1.1 C2.1 C3.1 C4.1 C5.1 C6.1 C7.1 C8.1 C9.1 C10.1 C11.1 C12.1 C13.1 C14.1 C15.1 C16.2 C17.1 C18.1 C19.2 C20.2 C21.2 C22.1 C23.1 C24.2 C25.2 C26.1 C27.2 C28.2 C29.1 C31.2 C32.1 C33.1 C34.1 C35.2 C36.2 C37.2 C38.2 C39.2 C40.2 C41.1 C42.1 C43.2 C44.1 C45.1 C46.1 C47.2 C48.1 C49.1 C50.1 C51.1 C52.1 C53.2 C54.1 C55.2 C56.1 C57.1 C58.1 C59.2 C60.1 C61.2 C62.1 C63.1 C64.1 C65.2 C66.2 C67.2 C68.2 C69.2 C70.2 C71.2 C72.2 C73.2 C74.2 C75.2 C76.2 C77.2 C78.2 C79.2 C80.2 C81.2 C82.2 C83.2 C84.2 C85.2 C86.2 C87.2 C88.2 C100.1 CAPT.1 D15.2 D21.P$2(A) D22.P$2(A) D23.2 D25.P$2(A) D26.P$2(A) D28.2(A) J1.5 J2.1 J2.7 J2.8 J2.13 J2.14 J2.19 J2.20 J2.25 J2.26 J2.31 J2.32 J2.37 J2.38 J2.43 J2.44 J2.49 J2.50 J2.55 J2.56 J2.61 J2.62 J2.68 J2.73 J2.74 J2.79 J2.80 J2.85 J2.86 J2.91 J2.92 J2.97 J2.98 J2.103 J2.104 J2.109 J2.110 J2.115 J2.116 J2.121 J2.122 J2.127 J2.133 J2.134 J2.139 J2.140 J2.145 J2.146 J2.151 J2.152 J2.157 J2.163 J2.164 J2.169 J2.170 J2.181 J2.182 J2.187 J2.188 J2.195 J2.196 J3.2 J4.2 J5.2 J5.4 J6.1 J6.2 J8.2 J8.3 J9.6 J10.4 J11.3 J13.9 KEY1.1 LED2.2 LED3.2 LED4.2 LED5.2 P2.2 P2.11 P2.12 P2.14 P2.15 P2.16 P2.19 P2.20 P3.14 P3.15 P3.19 P4.7 P4.9 Q4.2(E) Q9.2(S) Q10.2(E) Q11.2(E) Q12.2(E) Q13.2(E) Q14.1(G) Q15.2(E) R1.1 R3.1 R4.1 R5.1 R6.1 R7.1 R8.1 R20.1 R21.1 R25.1 R26.1 R28.2 R32.1 R33.1 R37.2 R44.1 R44.2 R52.1 R53.1 R54.2 R62.1 R64.1 R67.2 R71.1 R74.1 R78.1 R82.1 R83.1 R88.1 R89.1 R96.1 R97.1 U1.1(GND) U2.1(GND) U3.4(GND) U3.5(GND) U3.6(GND) U4.4(GND) U4.5(GND) U4.6(GND) U7.7 U10.3(GND) U11.3(GND) U12.1(Enable) U12.2(GND) U13.8(GND) U13.21(AREF) U13.22(GND) U15.4(GND) U16.30(VSSA) U16.38(VSS) U16.51(VSS) U16.61(VSS) U16.71(VSS) U16.83(VSS) U16.94(VSS) U16.107(VSS) U16.120(VSS) U16.130(VSS) U16.143(VSS) U17.4(GND) U18.4(GND) U19.13(GND) U20.4(GND) U21.4(GND) U22.4(GND) U23.4(GND) U24.2 U25.1(GND) U26.4(GND) U27.1(Enable) U27.2(GND) U28.4(GND) U29.5(GND) U30.5(GND) U31.4(GND) U32.4(GND) U33.4(GND) U34.5(GND) U35.5(GND) U36.4(GND) U37.5(GND) U38.4(GND) U39.4(GND) U40.5(GND) U41.5(GND) U42.4(GND) U43.5(GND) U44.4(GND)
V3V: C41.2 C42.2 D24.1 D28.1(K) L1.2 L5.1 L5.2 P3.24 R22.2
V5: C24.1 D20.2 L2.2 U10.2(EN)
V5VA: J2.47 R14.2
V12_SUPPLY: D16.2 D17.2 J5.1 J5.3 J8.4 P2.3 P2.5 R27.1
V12V: C25.1 C28.1 C65.1 C69.1 C70.1 C76.1 C77.1 C78.1 C85.1 C87.1 D16.1 D17.1 D18.1 D19.1 D33.1 D52.1 J1.1 J1.2 J4.1 J12.1 J14.1 J15.1 J16.1 P1.1 P3.7 P3.11 U8.1 U10.1(ADJ) U11.1(ADJ) U31.8(GAIN) U32.8(GAIN) U33.8(GAIN) U36.8(GAIN) U38.8(GAIN) U39.8(GAIN) U42.8(GAIN) U44.8(GAIN) U45.1
V12VA: J2.45 R13.2
VBAT: U19.14(VBAT)
VDD33A: C1.2 C2.2 C3.2 C4.2 C5.2 C6.2 C7.2 C8.2 C9.2 C10.2 C11.2 J2.39 J2.40 J2.41 J2.42 J2.189 J2.191 J2.192 J2.193 J2.194 J2.198 J2.200 L1.1 R11.1
12C_2_SCL: U13.28((PCINT14SCLADC5)PC5)
12C_2_SDA: U13.27((PCINT12SDAADC4)PC4)
32K: U19.1(32KHZ)
32k: U16.29(PC3)
ANG_1: C100.2 D22.P$1(C) R23.1 R26.2 U13.26((PCINT11ADC3)PC3)
ANG_2: CAPT.2 D26.P$1(C) R30.1 R33.2 U13.25((PCINT10ADC2)PC2)
ANG_3: C22.2 D21.P$1(C) R22.1 R25.2 U13.24((PCINT9ADC1)PC1)
ANG_4: C.2 D25.P$1(C) R29.1 R32.2
AUX_SCL: P3.5 P3.13 P3.21 P3.22 R85.1 R87.1 R93.1 R95.1 U16.26(PC0) U19.16(SCL) U20.6(SCL)
aux_sw: C30.2 L4.1 Q8.2(S) Q9.3(D) U14.5(SW)
AUX_VCC: C17.2 C33.2 C39.1 C40.1 D4.1 D5.1 D7.1 D9.1 D10.1 D12.1 D14.1 D20.1 D27.2 J3.1 P2.7 P2.9 P3.2 P3.6 Q1.3(C) Q2.3(C) Q3.3(C) Q8.3(D) R23.2 R29.2 R38.1 R39.1 R40.1 R42.1 R79.2 SP1.+(1) U13.7(VCC) U13.20(AVCC) U14.4(VIN) U14.6(FREQ) U19.2(VCC) U20.8(VCC) U29.4(AVDD/VREF) U30.4(AVDD/VREF) U34.4(AVDD/VREF) U35.4(AVDD/VREF) U37.4(AVDD/VREF) U40.4(AVDD/VREF) U41.4(AVDD/VREF) U43.4(AVDD/VREF)
BAT_SPLY: D1.1 D2.1 R30.2
BLUE: J2.23 Q3.1(B)
CHARGE: Q5.1(G) R12.2 U13.12((PCINT22OC0AAIN0)PD6)
CHRG_CMPLT: Q6.1(E) U13.11((PCINT21OC0BT1)PD5) U13.13((PCINT23AIN1)PD7)
CO2-OUT: J2.57 P3.3 R83.2
CPU_BUZ: D29.2 J2.36
cpu_cs: J2.27 U16.90(PG5)
cpu_miso: J2.29 U16.88(PG3)
cpu_mosi: J2.33 U16.89(PG4)
cpu_sck: J2.35 U16.87(PG2)
CS-T: J2.58 U1.5(CS#)
CS-T2: J2.54 U2.5(CS#)
CS_TEMP: U16.140(PB9) U25.5(CS#)
CSK_TEMP: U25.4(SCK)
F1_OUT: D37.1 D40.1 J13.1
F2_OUT: D38.1 D41.1 J13.2
F3_OUT: D43.1 D46.1 J13.3
F4_OUT: D44.1 D47.1 J13.4
F5_OUT: D48.1 D50.1 J13.5
F6_OUT: D42.1 D45.1 J13.6
F7_OUT: D36.1 D39.1 J13.7
F8_OUT: D49.1 D51.1 J13.8
GREEN: J2.21 Q2.1(B)
H2-Pa-an: R89.2 R91.2 R97.2 R99.2 U16.41(PA5)
H5V: C16.1 J3.3
H-Pa-an: R88.2 R90.2 R96.2 R98.2 U16.100(PA8)
HDMI-CEC: J2.171
HDMI-CKN: J2.111
HDMI-CKP: J2.113
HDMI-HPD: J2.88
HDMI-SCL: J2.175
HDMI-SDA: J2.173
HDMI-T1N: J2.123
HDMI-T1P: J2.125
HDMI-T2N: J2.129
HDMI-T2P: J2.131
HDMI-TON: J2.117
HDMI-TOP: J2.119
HEATER: R81.1 U16.68(PE15)
HF-SDA: P3.1 P3.9 P3.17 P3.23 R84.2 R86.2 R92.2 R94.2 U16.27(PC1) U19.15(SDA) U20.5(SDA)
HP2-an: P3.8 R90.1 R98.1
HP-an: P3.4 R91.1 R99.1
HUMIDITY: P3.12 R76.1 U16.112(PC11)
I2C_1_SCL: R50.2 R51.2 U16.129(PG14) U29.2(SCLK) U30.2(SCLK) U35.2(SCLK) U41.2(SCLK)
I2C_1_SDA: R46.1 R47.1 U16.128(PG13) U29.1(SYNC) U30.1(SYNC) U35.1(SYNC) U41.1(SYNC)
I2C_2_SCL: U16.11(PF1)
I2C_2_SDA: U16.10(PF0)
I2C_4_SCL: R63.2 U16.81(PD12) U34.2(SCLK) U37.2(SCLK) U40.2(SCLK) U43.2(SCLK)
I2C_4_SDA: R59.1 U16.82(PD13) U34.1(SYNC) U37.1(SYNC) U40.1(SYNC) U43.1(SYNC)
in1: U16.23(PH0-OSC_IN)
in2: U16.8(PC14-OSC32_IN)
IN-1: U31.6(VCC)
IN-2: U32.6(VCC)
IN-3: U38.6(VCC)
IN-4: U39.6(VCC)
IN-5: U42.6(VCC)
IN-6: U36.6(VCC)
IN-7: U33.6(VCC)
IN-8: U44.6(VCC)
MCU_BUZ: D30.2 U16.18(PF6)
MEM_CS: U16.114(PD0) U17.1(CS#)
MEM_CS1: U16.118(PD4) U18.1(CS#)
MEM_CS2: U16.116(PD2) U23.1(CS#)
MEM_CS3: U16.117(PD3) U26.1(CS#)
MEM_CS4: U16.115(PD1) U21.1(CS#)
MEM_CS5: U15.1(CS#) U16.119(PD5)
MEM_CS6: U16.122(PD6) U22.1(CS#)
MEM_CS7: U16.123(PD7) U28.1(CS#)
MEM_MISO: U15.2(SO/SIO1) U16.125(PG10) U17.2(SO/SIO1) U18.2(SO/SIO1) U21.2(SO/SIO1) U22.2(SO/SIO1) U23.2(SO/SIO1) U26.2(SO/SIO1) U28.2(SO/SIO1)
MEM_MOSI: U15.5(SI/SIO0) U16.126(PG11) U17.5(SI/SIO0) U18.5(SI/SIO0) U21.5(SI/SIO0) U22.5(SI/SIO0) U23.5(SI/SIO0) U26.5(SI/SIO0) U28.5(SI/SIO0)
MEM_RST: U15.7(RESET#SIO3) U17.7(RESET#SIO3) U18.7(RESET#SIO3) U21.7(RESET#SIO3) U22.7(RESET#SIO3) U23.7(RESET#SIO3) U26.7(RESET#SIO3) U28.7(RESET#SIO3)
MEM_SCK: U15.6(SCLK) U16.124(PG9) U17.6(SCLK) U18.6(SCLK) U21.6(SCLK) U22.6(SCLK) U23.6(SCLK) U26.6(SCLK) U28.6(SCLK)
miso: J9.2 U13.18((PCINT4MISO)PB4)
MISO: U16.75(PB14) U25.6(SO)
MISO-T: J2.60 J2.64 U1.6(SO) U2.6(SO)
mosi: J9.1 U13.17((PCINT3OC2AMOSI)PB3)
MOSI: U16.76(PB15) U25.2(SI)
MOSI-T: U1.2(SI) U2.2(SI)
NEBU: R80.1 U16.22(PF10)
NRST: C62.2 J10.3 KEY1.3 U16.25(NRST)
out1: U16.24(PH1-OSC_OUT)
out2: U16.9(PC15-OSC32_OUT)
OXY-IN: P3.16 R77.2 U16.101(PA9)
OXY-OUT: P3.18 R78.2 U16.102(PA10)
PHOTO-DIODE: J2.63 P4.5
POWER-FAN: D35.2 U16.63(PE10)
PWR-STAT: R1.2 R2.1
PWR_ON: P2.18 Q10.3(C) U13.14((PCINT0CLKOICP1)PB0)
PWR_STAT: J2.3
RASP-FAN: U6.2
RASP_FAN: J2.34
RD-IRO1: J2.65 P4.3
RD-IRO2: J2.69 P4.2
RED: J2.17 Q1.1(B)
rst: J9.5 U13.1((PCINT14RESET)PC6)
RX: J11.1 U16.35(PA1)
sck: J9.3 U13.19((PCINT5SCK)PB5)
SCK-T: J2.66 U1.4(SCK) U2.4(SCK)
SCK_TEMP: U16.74(PB13)
SLV-BUZ: U13.6((PCINT20XCKT0)PD4)
SLV-FAN: D34.2 U13.5((PCINT19OC2BINT1)PD3)
SLV_BUZ: D31.2
SQW: U16.28(PC2) U19.3(INT#/SQW)
SS: J9.4 U13.16((PCINT2OC1BSS)PB2)
STM-FAN: U5.2
STM_FAN: U16.66(PE13)
sup_check: D7.2 P2.8
SWCLK: J10.1 U16.109(PA14)
SWDIO: J10.2 U16.105(PA13)
TCH-D+: J2.165 U3.3(D+) U4.2(D-)
TCH-D-: J2.167 U3.2(D-) U4.3(D+)
TEMP-SENS: P3.10 R82.2 U16.98(PC8)
TX: J11.2 U16.34(PA0)
VTCK: J2.180 U7.6
VTDI: J2.174 U7.5
VTDO: J2.178 U7.4
VTMS: J2.176 U7.8
VTRST: J2.172 U7.3
Net-(C18-2): C18.2 Q4.3(C) R10.1
Net-(C19-1): C19.1 J2.4 J2.6 R11.2
Net-(C20-1): C20.1 R17.1 R19.2 U9.1(ADJ)
Net-(C21-1): C21.1 U9.2(OUTPUT)
Net-(C23-2): C23.2 R24.1
Net-(C26-2): C26.2 R31.1
Net-(C29-2): C29.2 U12.4(VDD) U13.9((PCINT6XTAL1TOSC1)PB6)
Net-(C30-1): C30.1 D27.1 U14.3(BOOST)
Net-(C31-1): C31.1 U12.3(OUT) U13.10((PCINT7XTAL2TOSC2)PB7)
Net-(C32-2): C32.2 R35.1
Net-(C44-2): C44.2 Q11.3(C) SP1.-(2)
Net-(C48-2): C48.2 Y1.2(OSC2)
Net-(C49-2): C49.2 Y1.1(OSC1)
Net-(C55-1): C55.1 U27.4(VDD)
Net-(C57-2): C57.2 Q12.3(C) R43.1
Net-(C61-1): C61.1 U27.3(OUT)
Net-(C66-1): C66.1 R48.2 R55.2 U31.3(IN1+) U31.7(BYPASS)
Net-(C67-1): C67.1 R49.2 R56.2 U32.3(IN1+) U32.7(BYPASS)
Net-(C68-1): C68.1 D39.2 R57.2 U33.1(GAIN)
Net-(C71-1): C71.1 D40.2 R55.1 U31.1(GAIN)
Net-(C72-1): C72.1 D41.2 R56.1 U32.1(GAIN)
Net-(C73-1): C73.1 R57.1 R58.2 U33.3(IN1+) U33.7(BYPASS)
Net-(C74-1): C74.1 R60.2 R65.2 U36.3(IN1+) U36.7(BYPASS)
Net-(C75-1): C75.1 R61.2 R66.2 U38.3(IN1+) U38.7(BYPASS)
Net-(C79-1): C79.1 D45.2 R65.1 U36.1(GAIN)
Net-(C80-1): C80.1 D46.2 R66.1 U38.1(GAIN)
Net-(C81-1): C81.1 D47.2 R68.2 U39.1(GAIN)
Net-(C82-1): C82.1 R68.1 R69.2 U39.3(IN1+) U39.7(BYPASS)
Net-(C83-1): C83.1 R70.2 R73.2 U42.3(IN1+) U42.7(BYPASS)
Net-(C84-1): C84.1 R72.2 R75.2 U44.3(IN1+) U44.7(BYPASS)
Net-(C86-1): C86.1 D50.2 R73.1 U42.1(GAIN)
Net-(C88-1): C88.1 D51.2 R75.1 U44.1(GAIN)
Net-(D1-2): D1.2 D2.2 D8.P$1(C) Q5.3(S) R18.2
Net-(D3-2): D3.2 P2.1
Net-(D4-2): D4.2 P2.4
Net-(D5-2): D5.2 P2.6
Net-(D6-P$1): D6.P$1(C) F1.2
Net-(D6-P$2): D6.P$2(A) R17.2 U9.3(INPUT)
Net-(D8-P$2): D8.P$2(A) Q6.2(B)
Net-(D9-2): D9.2 P2.13
Net-(D10-2): D10.2 P2.17
Net-(D11-2): D11.2 J8.1
Net-(D12-2): D12.2 P2.21
Net-(D13-2): D13.2 P2.24
Net-(D14-2): D14.2 P2.23
Net-(D15-1): D15.1 L2.1 U10.4(VOUT)
Net-(D18-2): D18.2 D19.2 Q7.4(D)
Net-(D23-1): D23.1 L3.1 U11.4(VOUT)
Net-(D29-1): D29.1 D30.1 D31.1 R41.1
Net-(D32-1): D32.1 U24.1
Net-(D32-2): D32.2 R42.2
Net-(D33-2): D33.2 J12.2 R43.2
Net-(D34-1): D34.1 D35.1 R45.1
Net-(D36-2): D36.2 U33.5(VOUT)
Net-(D37-2): D37.2 U31.5(VOUT)
Net-(D38-2): D38.2 U32.5(VOUT)
Net-(D42-2): D42.2 U36.5(VOUT)
Net-(D43-2): D43.2 U38.5(VOUT)
Net-(D44-2): D44.2 U39.5(VOUT)
Net-(D48-2): D48.2 U42.5(VOUT)
Net-(D49-2): D49.2 U44.5(VOUT)
Net-(D52-2): D52.2 J15.2 Q14.2(S)
Net-(F1-1): F1.1 Q5.2(D) R12.1
Net-(J1-3): J1.3 J1.4 R2.2
Net-(J2.1-82): J2.82 R6.2
Net-(J2.1-84): J2.84 R5.2
Net-(J2.1-168): J2.168 R3.2
Net-(J2.2-28): J2.28 R8.2
Net-(J2.2-30): J2.30 R7.2
Net-(J7-1): J7.1 J7.2 Q6.3(C) R18.1 R20.2
Net-(J14-2): J14.2 J16.2 Q13.3(C) U45.2
Net-(LED1-1): LED1.1(K) Q3.2(E)
Net-(LED1-2): LED1.2(K) Q2.2(E)
Net-(LED1-3): LED1.3 R4.2
Net-(LED1-4): LED1.4(K) Q1.2(E)
Net-(LED2-1): LED2.1 R13.1
Net-(LED3-1): LED3.1 R14.1
Net-(LED4-1): LED4.1 R15.1
Net-(LED5-1): LED5.1 R16.1
Net-(P1-2): P1.2 R10.2 U8.2
Net-(Q4-1): Q4.1(B) R9.1
Net-(Q7-1): Q7.1(G) R27.2 R28.1
Net-(Q8-1): Q8.1(G) U14.2(TG)
Net-(Q9-1): Q9.1(G) U14.1(BG)
Net-(Q10-1): Q10.1(B) R34.2
Net-(Q11-1): Q11.1(B) R41.2
Net-(Q12-1): Q12.1(B) R45.2
Net-(Q13-1): Q13.1(B) R80.2
Net-(Q14-3): Q14.3(D) Q15.3(C) R79.1
Net-(Q15-1): Q15.1(B) R81.2
Net-(R9-2): R9.2 U5.1 U6.1
Net-(R19-1): R19.1 R21.2
Net-(R24-2): R24.2 U10.5(VIN)
Net-(R31-2): R31.2 U11.5(VIN)
Net-(R35-2): R35.2 U14.9(ITH)
Net-(R36-2): R36.2 R37.1 U14.8(VFB)
Net-(R38-2): R38.2 U20.1(A0)
Net-(R39-2): R39.2 U20.2(A1)
Net-(R40-2): R40.2 U20.3(A2)
Net-(R48-1): R48.1 U29.6(VOUT)
Net-(R49-1): R49.1 U30.6(VOUT)
Net-(R52-2): R52.2 U31.2(IN1-)
Net-(R53-2): R53.2 U32.2(IN1-)
Net-(R54-1): R54.1 U33.2(IN1-)
Net-(R58-1): R58.1 U34.6(VOUT)
Net-(R60-1): R60.1 U35.6(VOUT)
Net-(R61-1): R61.1 U37.6(VOUT)
Net-(R62-2): R62.2 U36.2(IN1-)
Net-(R64-2): R64.2 U38.2(IN1-)
Net-(R67-1): R67.1 U39.2(IN1-)
Net-(R69-1): R69.1 U40.6(VOUT)
Net-(R70-1): R70.1 U41.6(VOUT)
Net-(R71-2): R71.2 U42.2(IN1-)
Net-(R72-1): R72.1 U43.6(VOUT)
Net-(R74-2): R74.2 U44.2(IN1-)

Not connected (* = marked no-connect by the designer): J2 2* 5* 9* 10* 11* 12* 15* 16* 18* 22* 24* 46* 48* 52* 59* 67 70* 71* 72* 75* 76* 77* 78* 81* 83* 87* 89* 90* 93* 94* 95* 96* 99* 100* 101* 102* 105* 106* 107* 108* 112* 114* 118* 120* 124* 126* 128* 130* 132* 135* 136* 137* 138* 141* 142* 143* 144* 147* 148* 149* 150* 153* 154* 155* 156* 158* 159* 160* 161* 162* 166* 177* 179* 197* 199*; KEY1 2* 4*; P2 10* 22*; P4 1* 4* 6* 8* 10(MH1)* 11(MH2)*; Q7 3(S); U7 1* 2* 9* 10*; U13 2((PCINT16RXD)PD0)* 3((PCINT17TXD)PD1)* 4((PCINT18INT0)PD2)* 15((PCINT1OC1A)PB1)* 23((PCINT8ADC0)PC0)*; U14 7(IPRG) 10(RUN) 11(EP); U15 3(WP#/SIO2)* 9(EP)*; U16 1(PE2)* 2(PE3)* 3(PE4)* 4(PE5)* 5(PE6)* 7(PC13)* 12(PF2)* 13(PF3)* 14(PF4)* 15(PF5)* 16(VSS) 19(PF7)* 20(PF8)* 21(PF9)* 31(VREF-)* 36(PA2)* 37(PA3)* 40(PA4)* 42(PA6)* 43(PA7)* 44(PC4)* 45(PC5)* 46(PB0)* 47(PB1)* 48(PB2)* 49(PF11)* 50(PF12)* 53(PF13)* 54(PF14)* 55(PF15)* 56(PG0)* 57(PG1)* 58(PE7)* 59(PE8)* 60(PE9)* 64(PE11)* 65(PE12)* 67(PE14)* 69(PB10)* 70(PB11)* 73(PB12)* 77(PD8)* 78(PD9)* 79(PD10)* 80(PD11)* 85(PD14)* 86(PD15)* 91(PG6)* 92(PG7)* 93(PG8)* 97(PC7)* 99(PC9)* 103(PA11)* 104(PA12)* 110(PA15)* 111(PC10)* 113(PC12)* 127(PG12)* 132(PG15)* 133(PB3)* 134(PB4)* 135(PB5)* 136(PB6)* 137(PB7)* 138(PH3-BOOT0)* 139(PB8)* 141(PE0)* 142(PE1)*; U17 3(WP#/SIO2)* 9(EP)*; U18 3(WP#/SIO2)* 9(EP)*; U19 4(RST#)* 5(N.C.)* 6(N.C.)* 7(N.C.)* 8(N.C.)* 9(N.C.)* 10(N.C.)* 11(N.C.)* 12(N.C.)*; U20 7(WP)*; U21 3(WP#/SIO2)* 9(EP)*; U22 3(WP#/SIO2)* 9(EP)*; U23 3(WP#/SIO2)* 9(EP)*; U26 3(WP#/SIO2)* 9(EP)*; U28 3(WP#/SIO2)* 9(EP)*

## Notes on the sheets
sheet 1
- POWER ON BUTTON
- Debug USB
- Touch Screen USB
sheet 4
- ACTUATOR 1
- ACTUATOR 3
- ACTUATOR 2
- ACTUATOR 6
- ACTUATOR 4
- ACTUATOR 5
- ACTUATOR 7
- ACTUATOR 8
